# EAGLE schematic cs_debug_v1 (EAGLE 9.6.1)

## Sheet 1 of 3
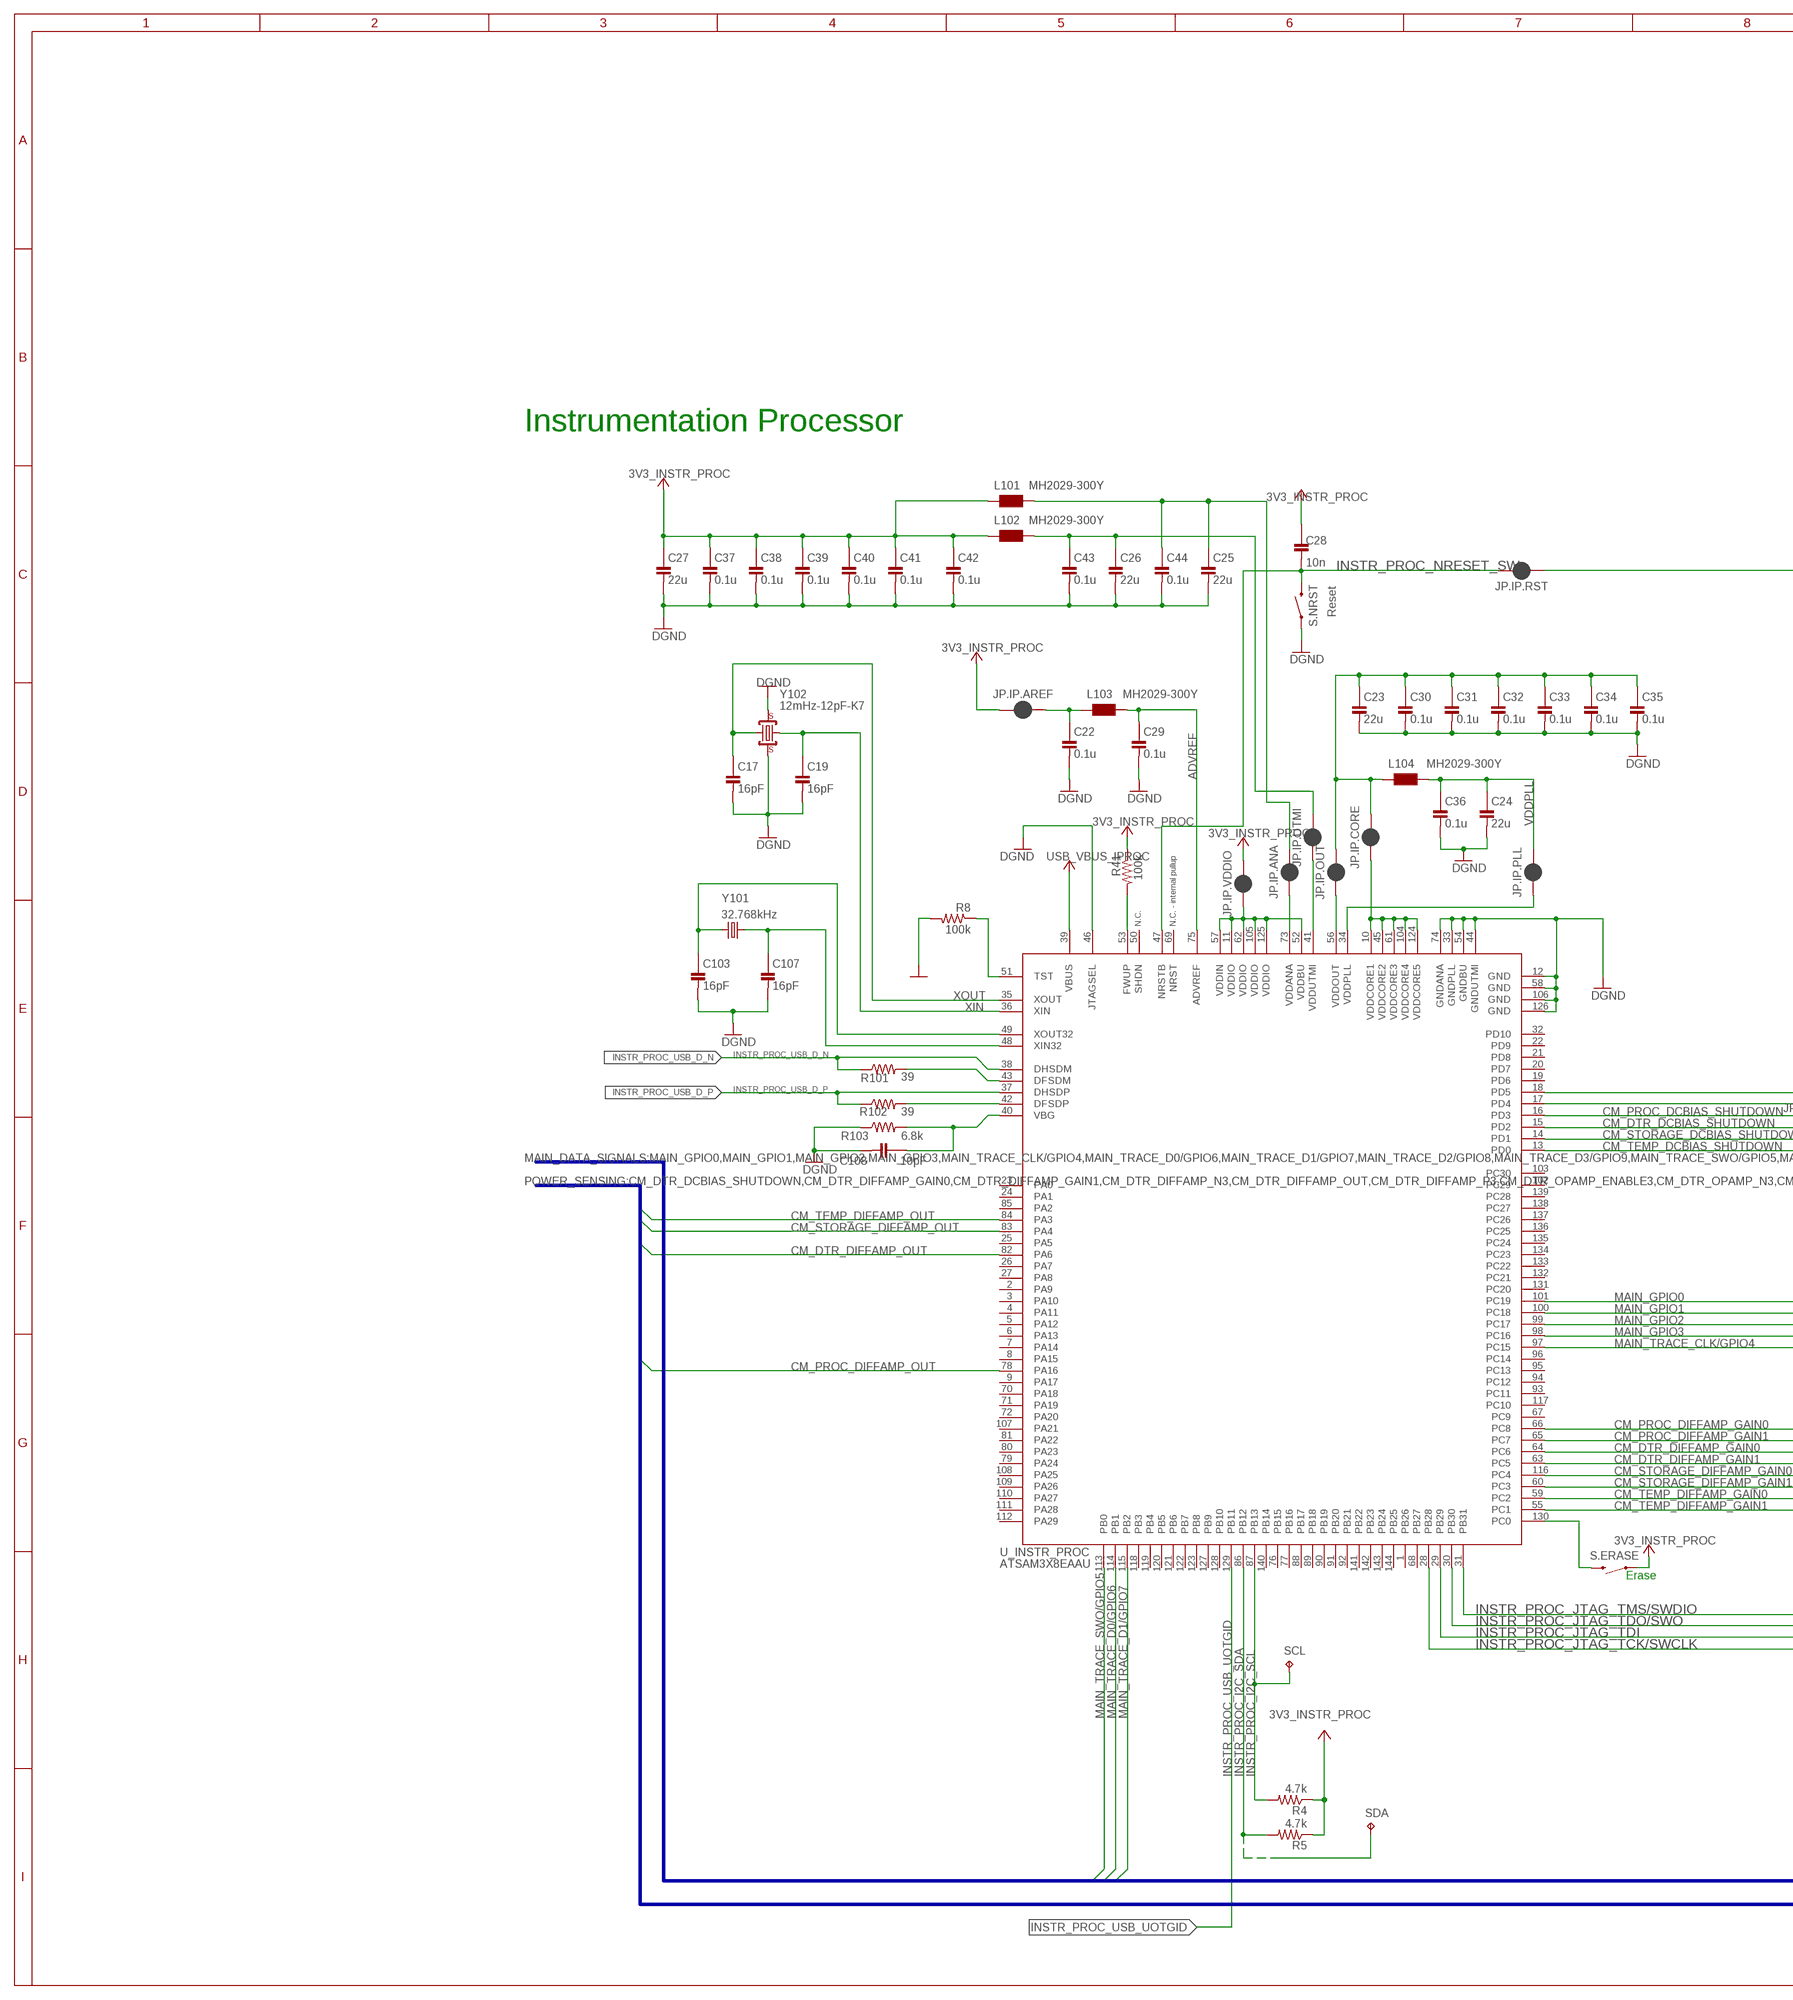
[diagram p0: schematic, sheet 1, part 1 of 2]
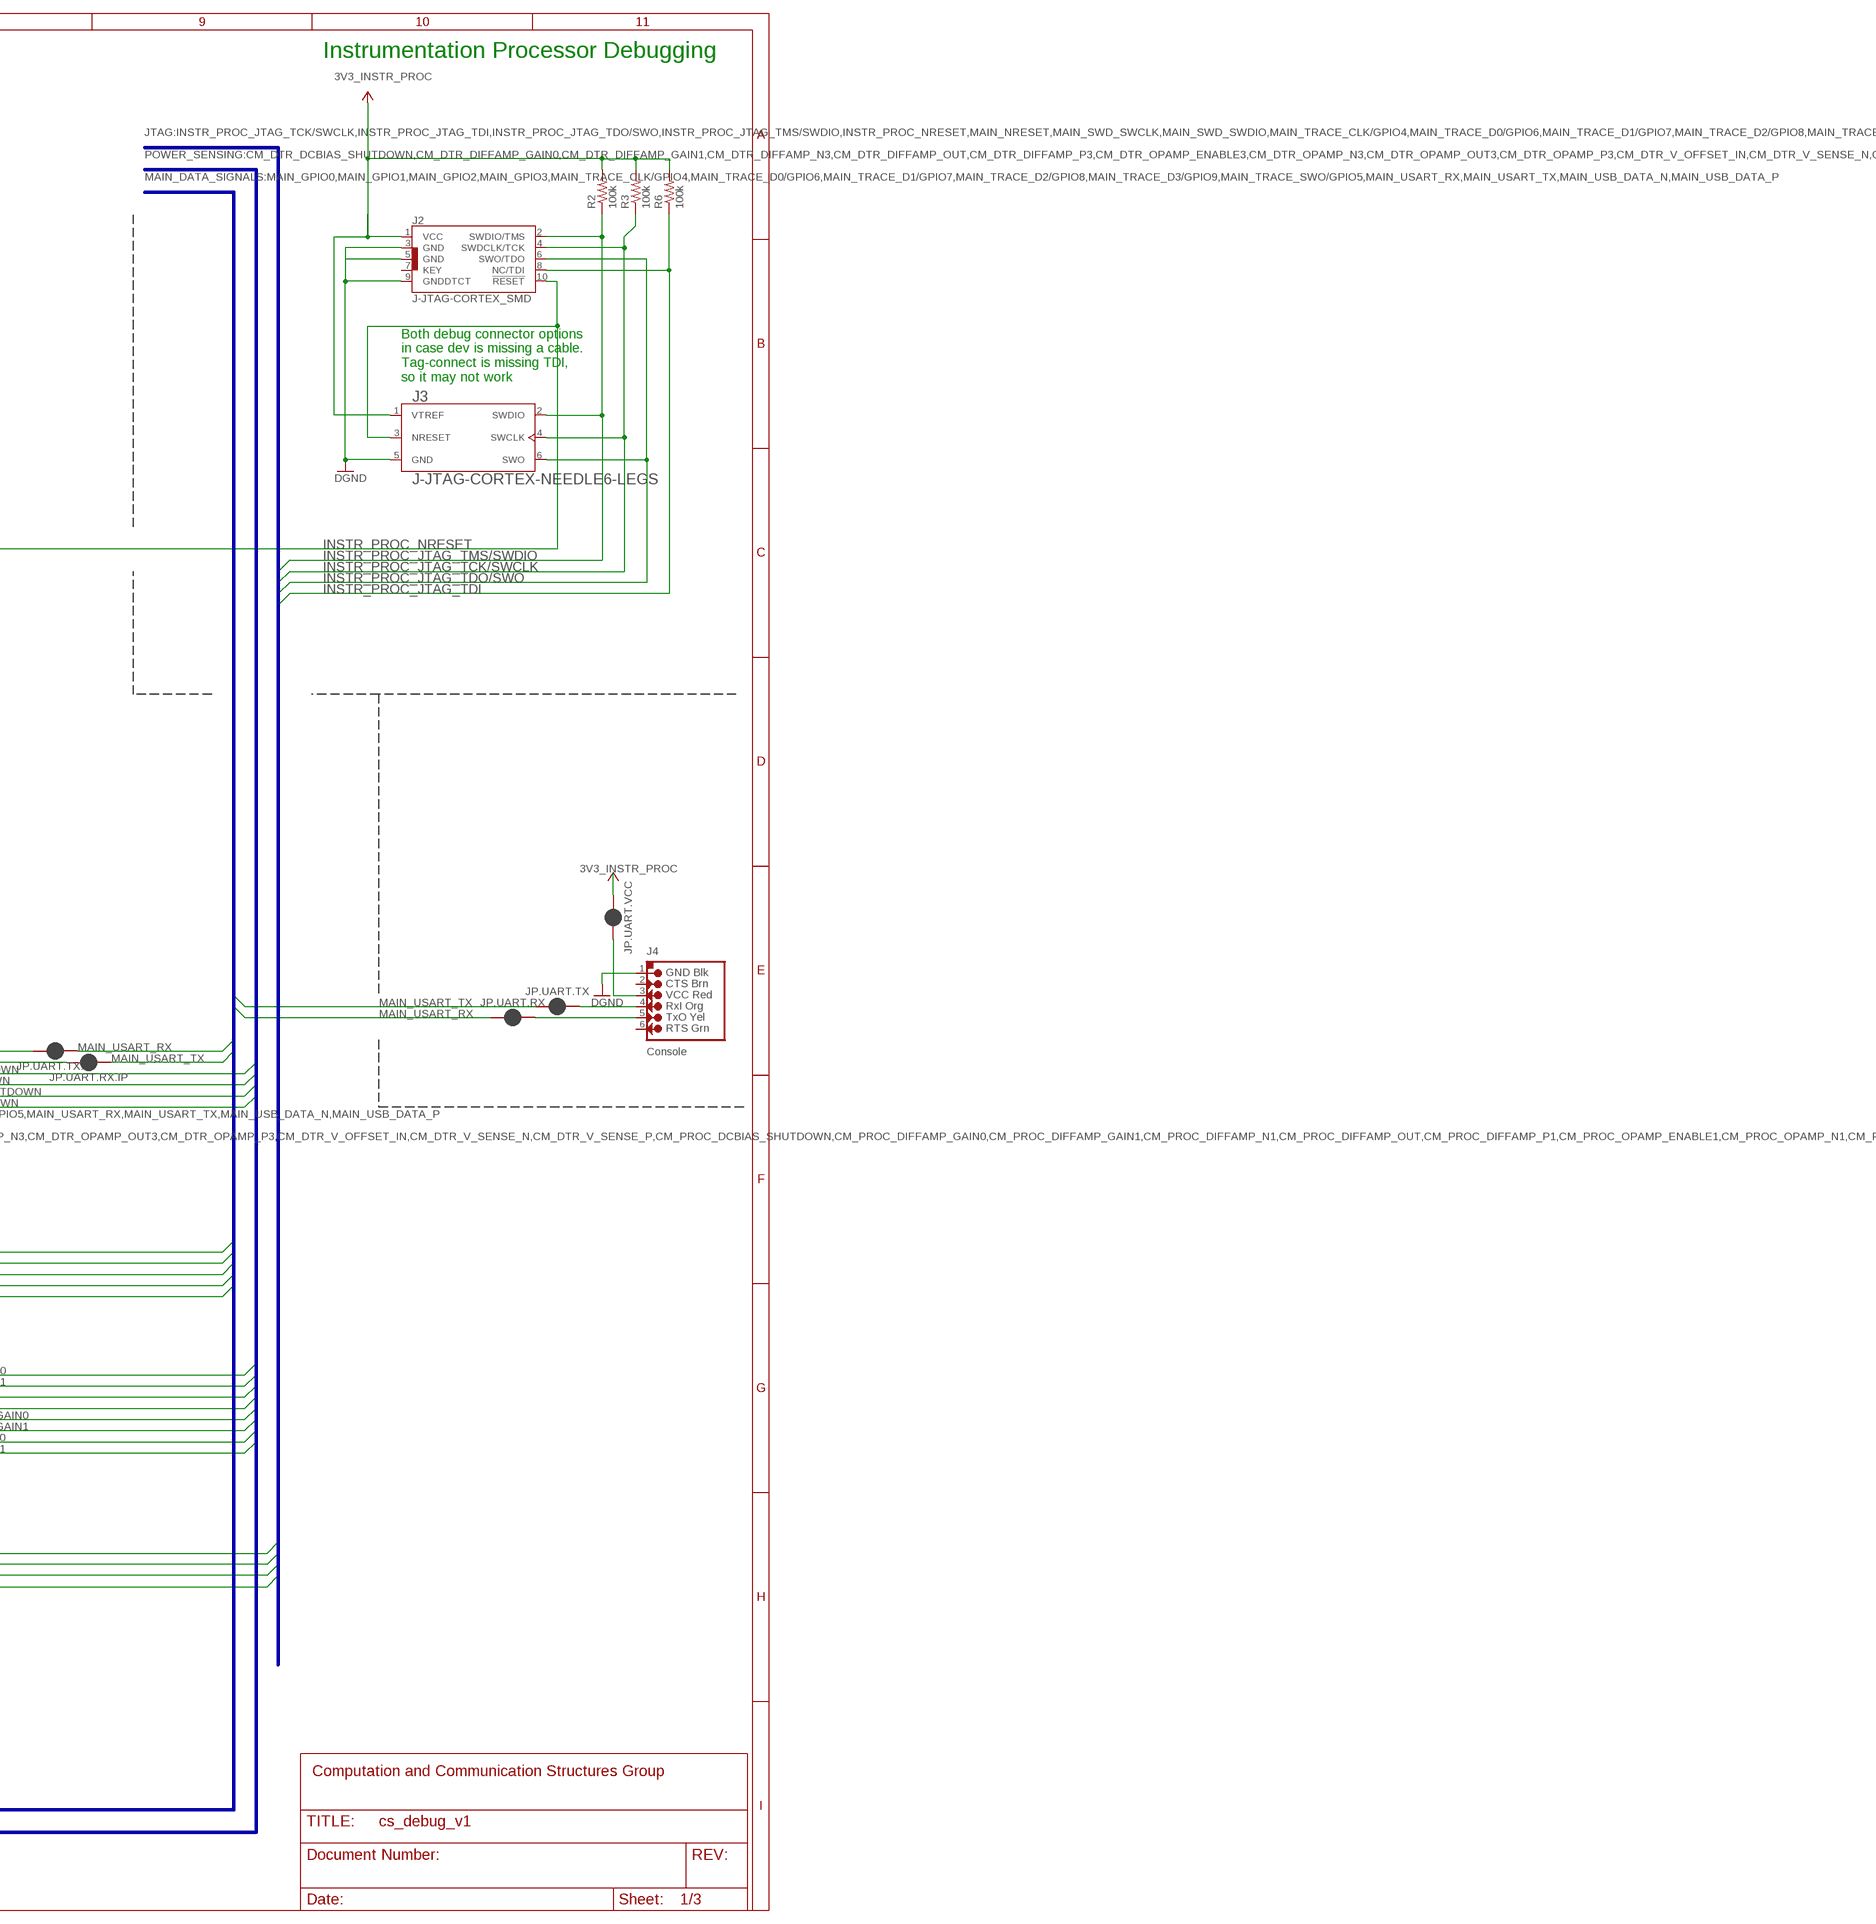
[diagram p1: schematic, sheet 1, part 2 of 2]

### Parts
C17  16pF  C-0603  [C0603]
C19  16pF  C-0603  [C0603]
C22  0.1u  C-0402  [C0402]
C23  22u  C-0805  [C0805]
C24  22u  C-0805  [C0805]
C25  22u  C-0805  [C0805]
C26  22u  C-0805  [C0805]
C27  22u  C-0805  [C0805]
C28  10n  C-0402  [C0402]
C29  0.1u  C-0402  [C0402]
C30  0.1u  C-0402  [C0402]
C31  0.1u  C-0402  [C0402]
C32  0.1u  C-0402  [C0402]
C33  0.1u  C-0402  [C0402]
C34  0.1u  C-0402  [C0402]
C35  0.1u  C-0402  [C0402]
C36  0.1u  C-0402  [C0402]
C37  0.1u  C-0402  [C0402]
C38  0.1u  C-0402  [C0402]
C39  0.1u  C-0402  [C0402]
C40  0.1u  C-0402  [C0402]
C41  0.1u  C-0402  [C0402]
C42  0.1u  C-0402  [C0402]
C43  0.1u  C-0402  [C0402]
C44  0.1u  C-0402  [C0402]
C103  16pF  C-0603  [C0603]
C107  16pF  C-0603  [C0603]
C108  10pF  C-0603  [C0603]
J2  J-JTAG-CORTEX_SMD  [SAMTECH_FTSH-105-01]
J3  J-JTAG-CORTEX-NEEDLE6-LEGS  [8.06.16_6-PIN_NEEDLE_ADAPTER_LEGS]
J4  J-SERIAL-PORT  [HEADER-1X6]
JP.IP.ANA  JUMPER-SMT_2_NC_PASTE_NO-SILK  [SMT-JUMPER_2_NC_PASTE_NO-SILK]
JP.IP.AREF  JUMPER-SMT_2_NC_PASTE_NO-SILK  [SMT-JUMPER_2_NC_PASTE_NO-SILK]
JP.IP.CORE  JUMPER-SMT_2_NC_PASTE_NO-SILK  [SMT-JUMPER_2_NC_PASTE_NO-SILK]
JP.IP.OUT  JUMPER-SMT_2_NC_PASTE_NO-SILK  [SMT-JUMPER_2_NC_PASTE_NO-SILK]
JP.IP.PLL  JUMPER-SMT_2_NC_PASTE_NO-SILK  [SMT-JUMPER_2_NC_PASTE_NO-SILK]
JP.IP.RST  JUMPER-SMT_2_NC_PASTE_NO-SILK  [SMT-JUMPER_2_NC_PASTE_NO-SILK]
JP.IP.UTMI  JUMPER-SMT_2_NC_PASTE_NO-SILK  [SMT-JUMPER_2_NC_PASTE_NO-SILK]
JP.IP.VDDIO  JUMPER-SMT_2_NC_PASTE_NO-SILK  [SMT-JUMPER_2_NC_PASTE_NO-SILK]
JP.UART.RX  JUMPER-SMT_2_NC_PASTE_NO-SILK  [SMT-JUMPER_2_NC_PASTE_NO-SILK]
JP.UART.RX.IP  JUMPER-SMT_2_NC_PASTE_NO-SILK  [SMT-JUMPER_2_NC_PASTE_NO-SILK]
JP.UART.TX  JUMPER-SMT_2_NC_PASTE_NO-SILK  [SMT-JUMPER_2_NC_PASTE_NO-SILK]
JP.UART.TX.IP  JUMPER-SMT_2_NC_PASTE_NO-SILK  [SMT-JUMPER_2_NC_PASTE_NO-SILK]
JP.UART.VCC  JUMPER-SMT_2_NC_PASTE_NO-SILK  [SMT-JUMPER_2_NC_PASTE_NO-SILK]
L101  MH2029-300Y  [L0805]
L102  MH2029-300Y  [L0805]
L103  MH2029-300Y  [L0805]
L104  MH2029-300Y  [L0805]
R2  100k  R-0402  [R0402]
R3  100k  R-0402  [R0402]
R4  4.7k  R-0402  [R0402]
R5  4.7k  R-0402  [R0402]
R6  100k  R-0402  [R0402]
R8  100k  R-0402  [R0402]
R41  100k  R-0402  [R0402]
R101  39  R-0402  [R0402]
R102  39  R-0402  [R0402]
R103  6.8k  R-0402  [R0402]
S.ERASE  Momentary  SW_EVQ-P7L01P_SPST_RA  [SW_EVQ-P7L01P]
S.NRST  Momentary  SW_EVQ-P7L01P_SPST_RA  [SW_EVQ-P7L01P]
SCL  TPTP10SQ  [TP10SQ]
SDA  TPTP10SQ  [TP10SQ]
U_INSTR_PROC  ATSAM3X8EA-AU  ATSAM3X8EAAU  [LQFP144]
Y101  32.768kHz  CRYSTAL3.2X1.5MM  [CRYSTAL-SMD-3.2X1.5MM]
Y102  12mHz-12pF-K7  0396_12MHZ-12PF-K7  [CRYSTAL-3.2-2.5]

### Nets
3V3_INSTR_PROC [power]: C27.1 C28.1 C37.1 C38.1 C39.1 C40.1 C41.1 C42.1 J2.1(VCC) J3.1(VTREF) JP.IP.AREF.1 JP.IP.VDDIO.2 JP.UART.VCC.1 L101.1 L102.1 R2.2 R3.2 R4.1 R5.1 R6.2 R41.1 S.ERASE.1_1 S.ERASE.1_2 ; supply symbol labelled +3V3 ; also sheet 2
ADVREF [power]: C29.1 L103.2 U_INSTR_PROC.75(ADVREF)
ADVREF_PRE [power]: C22.1 JP.IP.AREF.2 L103.1
CM_DTR_DCBIAS_SHUTDOWN: U_INSTR_PROC.15(PD2) ; also sheet 3
CM_DTR_DIFFAMP_GAIN0: U_INSTR_PROC.64(PC6) ; also sheet 3
CM_DTR_DIFFAMP_GAIN1: U_INSTR_PROC.63(PC5) ; also sheet 3
CM_DTR_DIFFAMP_OUT: U_INSTR_PROC.82(PA6) ; also sheet 3
CM_PROC_DCBIAS_SHUTDOWN: U_INSTR_PROC.16(PD3) ; also sheet 3
CM_PROC_DIFFAMP_GAIN0: U_INSTR_PROC.66(PC8) ; also sheet 3
CM_PROC_DIFFAMP_GAIN1: U_INSTR_PROC.65(PC7) ; also sheet 3
CM_PROC_DIFFAMP_OUT: U_INSTR_PROC.78(PA16) ; also sheet 3
CM_STORAGE_DCBIAS_SHUTDOWN: U_INSTR_PROC.14(PD1) ; also sheet 3
CM_STORAGE_DIFFAMP_GAIN0: U_INSTR_PROC.116(PC4) ; also sheet 3
CM_STORAGE_DIFFAMP_GAIN1: U_INSTR_PROC.60(PC3) ; also sheet 3
CM_STORAGE_DIFFAMP_OUT: U_INSTR_PROC.83(PA4) ; also sheet 3
CM_TEMP_DCBIAS_SHUTDOWN: U_INSTR_PROC.13(PD0) ; also sheet 3
CM_TEMP_DIFFAMP_GAIN0: U_INSTR_PROC.59(PC2) ; also sheet 3
CM_TEMP_DIFFAMP_GAIN1: U_INSTR_PROC.55(PC1) ; also sheet 3
CM_TEMP_DIFFAMP_OUT: U_INSTR_PROC.84(PA3) ; also sheet 3
DGND [GND]: C17.2 C19.2 C22.2 C23.2 C24.2 C25.2 C26.2 C27.2 C29.2 C30.2 C31.2 C32.2 C33.2 C34.2 C35.2 C36.2 C37.2 C38.2 C39.2 C40.2 C41.2 C42.2 C43.2 C44.2 C103.2 C107.2 C108.2 J2.3(GND) J2.5(GND) J2.9(GNDDTCT) J3.5(GND) J4.1(GND) R8.2 R103.1 S.NRST.1_1 S.NRST.1_2 U_INSTR_PROC.12(GND) U_INSTR_PROC.33(GNDPLL) U_INSTR_PROC.44(GNDUTMI) U_INSTR_PROC.46(JTAGSEL) U_INSTR_PROC.54(GNDBU) U_INSTR_PROC.58(GND) U_INSTR_PROC.74(GNDANA) U_INSTR_PROC.106(GND) U_INSTR_PROC.126(GND) Y102.2(GND) Y102.4(GND) ; supply symbol labelled GND ; also sheet 2
ERASE_S: S.ERASE.2_1 S.ERASE.2_2 U_INSTR_PROC.130(PC0)
FWUP: R41.2 U_INSTR_PROC.53(FWUP)
INSTR_PROC_I2C_SCL: R4.2 SCL.TP U_INSTR_PROC.87(PB13) ; also sheet 3
INSTR_PROC_I2C_SDA: R5.2 SDA.TP U_INSTR_PROC.86(PB12) ; also sheet 3
INSTR_PROC_JTAG_TCK/SWCLK: J2.4(SWDCLK/TCK) J3.4(SWCLK) R3.1 U_INSTR_PROC.28(PB28)
INSTR_PROC_JTAG_TDI: J2.8(NC/TDI) R6.1 U_INSTR_PROC.29(PB29)
INSTR_PROC_JTAG_TDO/SWO: J2.6(SWO/TDO) J3.6(SWO) U_INSTR_PROC.30(PB30)
INSTR_PROC_JTAG_TMS/SWDIO: J2.2(SWDIO/TMS) J3.2(SWDIO) R2.1 U_INSTR_PROC.31(PB31)
INSTR_PROC_NRESET: J2.10(!RESET) J3.3(NRESET) JP.IP.RST.1
INSTR_PROC_NRESET_SW: C28.2 JP.IP.RST.2 S.NRST.2_1 S.NRST.2_2 U_INSTR_PROC.47(NRSTB)
INSTR_PROC_USB_D_N: R101.1 U_INSTR_PROC.38(DHSDM) ; also sheet 2
INSTR_PROC_USB_D_P: R102.1 U_INSTR_PROC.37(DHSDP) ; also sheet 2
INSTR_PROC_USB_UOTGID [power]: U_INSTR_PROC.129(PB11)
MAIN_GPIO0: U_INSTR_PROC.101(PC19) ; also sheet 2
MAIN_GPIO1: U_INSTR_PROC.100(PC18) ; also sheet 2
MAIN_GPIO2: U_INSTR_PROC.99(PC17) ; also sheet 2
MAIN_GPIO3: U_INSTR_PROC.98(PC16) ; also sheet 2
MAIN_TRACE_CLK/GPIO4: U_INSTR_PROC.97(PC15) ; also sheet 2
MAIN_TRACE_D0/GPIO6: U_INSTR_PROC.114(PB1) ; also sheet 2
MAIN_TRACE_D1/GPIO7: U_INSTR_PROC.115(PB2) ; also sheet 2
MAIN_TRACE_SWO/GPIO5: U_INSTR_PROC.113(PB0) ; also sheet 2
MAIN_USART_RX: JP.UART.RX.1 JP.UART.TX.IP.1 ; also sheet 2
MAIN_USART_TX: JP.UART.RX.IP.1 JP.UART.TX.1 ; also sheet 2
N$2: R102.2 U_INSTR_PROC.42(DFSDP)
N$3: JP.UART.TX.IP.2 U_INSTR_PROC.18(PD5)
N$5: JP.UART.RX.IP.2 U_INSTR_PROC.17(PD4)
N$7: J4.4(RX-I) JP.UART.TX.2
N$9: J4.5(TX-O) JP.UART.RX.2
N$11: J4.3(VCC-I) JP.UART.VCC.2
N$13: R101.2 U_INSTR_PROC.43(DFSDM)
TST: R8.1 U_INSTR_PROC.51(TST)
USB_VBUS_IPROC [power]: U_INSTR_PROC.39(VBUS) ; supply symbol labelled +3V3 ; also sheet 2
VBG: C108.1 R103.2 U_INSTR_PROC.40(VBG)
VDDANA1 [power]: C25.1 C44.1 JP.IP.ANA.2 L101.2
VDDANA_0 [power]: JP.IP.ANA.1 U_INSTR_PROC.73(VDDANA)
VDDIO1 [power]: JP.IP.VDDIO.1 U_INSTR_PROC.11(VDDIO) U_INSTR_PROC.52(VDDBU) U_INSTR_PROC.57(VDDIN) U_INSTR_PROC.62(VDDIO) U_INSTR_PROC.105(VDDIO) U_INSTR_PROC.125(VDDIO)
VDDOUT [power]: C23.1 C30.1 C31.1 C32.1 C33.1 C34.1 C35.1 JP.IP.CORE.2 JP.IP.OUT.2 L104.1
VDDOUT_0 [power]: JP.IP.OUT.1 U_INSTR_PROC.56(VDDOUT)
VDDOUT_1 [power]: JP.IP.CORE.1 U_INSTR_PROC.10(VDDCORE1) U_INSTR_PROC.45(VDDCORE2) U_INSTR_PROC.61(VDDCORE3) U_INSTR_PROC.104(VDDCORE4) U_INSTR_PROC.124(VDDCORE5)
VDDOUTMI [power]: C26.1 C43.1 JP.IP.UTMI.2 L102.2
VDDOUTMI_0 [power]: JP.IP.UTMI.1 U_INSTR_PROC.41(VDDUTMI)
VDDPLL [power]: C24.1 C36.1 JP.IP.PLL.2 L104.2
VDDPLL_0 [power]: JP.IP.PLL.1 U_INSTR_PROC.34(VDDPLL)
XIN: C19.1 U_INSTR_PROC.36(XIN) Y102.1(C1)
XIN32: C107.1 U_INSTR_PROC.48(XIN32) Y101.P$1
XOUT: C17.1 U_INSTR_PROC.35(XOUT) Y102.3(C2)
XOUT32: C103.1 U_INSTR_PROC.49(XOUT32) Y101.P$2
Unconnected: J2.7(KEY) J4.2(CTS-O) J4.6(RTS) U_INSTR_PROC.1(PB26) U_INSTR_PROC.2(PA9) U_INSTR_PROC.3(PA10) U_INSTR_PROC.4(PA11) U_INSTR_PROC.5(PA12) U_INSTR_PROC.6(PA13) U_INSTR_PROC.7(PA14) U_INSTR_PROC.8(PA15) U_INSTR_PROC.9(PA17) U_INSTR_PROC.19(PD6) U_INSTR_PROC.20(PD7) U_INSTR_PROC.21(PD8) U_INSTR_PROC.22(PD9) U_INSTR_PROC.23(PA0) U_INSTR_PROC.24(PA1) U_INSTR_PROC.25(PA5) U_INSTR_PROC.26(PA7) U_INSTR_PROC.27(PA8) U_INSTR_PROC.32(PD10) U_INSTR_PROC.50(SHDN) U_INSTR_PROC.67(PC9) U_INSTR_PROC.68(PB27) U_INSTR_PROC.69(NRST) U_INSTR_PROC.70(PA18) U_INSTR_PROC.71(PA19) U_INSTR_PROC.72(PA20) U_INSTR_PROC.76(PB15) U_INSTR_PROC.77(PB16) U_INSTR_PROC.79(PA24) U_INSTR_PROC.80(PA23) U_INSTR_PROC.81(PA22) U_INSTR_PROC.85(PA2) U_INSTR_PROC.88(PB17) U_INSTR_PROC.89(PB18) U_INSTR_PROC.90(PB19) U_INSTR_PROC.91(PB20) U_INSTR_PROC.92(PB21) U_INSTR_PROC.93(PC11) U_INSTR_PROC.94(PC12) U_INSTR_PROC.95(PC13) U_INSTR_PROC.96(PC14) U_INSTR_PROC.102(PC29) U_INSTR_PROC.103(PC30) U_INSTR_PROC.107(PA21) U_INSTR_PROC.108(PA25) U_INSTR_PROC.109(PA26) U_INSTR_PROC.110(PA27) U_INSTR_PROC.111(PA28) U_INSTR_PROC.112(PA29) U_INSTR_PROC.117(PC10) U_INSTR_PROC.118(PB3) U_INSTR_PROC.119(PB4) U_INSTR_PROC.120(PB5) U_INSTR_PROC.121(PB6) U_INSTR_PROC.122(PB7) U_INSTR_PROC.123(PB8) U_INSTR_PROC.127(PB9) U_INSTR_PROC.128(PB10) U_INSTR_PROC.131(PC20) U_INSTR_PROC.132(PC21) U_INSTR_PROC.133(PC22) U_INSTR_PROC.134(PC23) U_INSTR_PROC.135(PC24) U_INSTR_PROC.136(PC25) U_INSTR_PROC.137(PC26) U_INSTR_PROC.138(PC27) U_INSTR_PROC.139(PC28) U_INSTR_PROC.140(PB14) U_INSTR_PROC.141(PB22) U_INSTR_PROC.142(PB23) U_INSTR_PROC.143(PB24) U_INSTR_PROC.144(PB25)

### Buses
JTAG:INSTR_PROC_JTAG_TCK/SWCLK,INSTR_PROC_JTAG_TDI,INSTR_PROC_JTAG_TDO/SWO,INSTR_PROC_JTAG_TMS/SWDIO,INSTR_PROC_NRESET,MAIN_NRESET,MAIN_SWD_SWCLK,MAIN_SWD_SWDIO,MAIN_TRACE_CLK/GPIO4,MAIN_TRACE_D0/GPIO6,MAIN_TRACE_D1/GPIO7,MAIN_TRACE_D2/GPIO8,MAIN_TRACE_D3/GPIO9,MAIN_TRACE_SWO/GPIO5
POWER_SENSING:CM_DTR_DCBIAS_SHUTDOWN,CM_DTR_DIFFAMP_GAIN0,CM_DTR_DIFFAMP_GAIN1,CM_DTR_DIFFAMP_N3,CM_DTR_DIFFAMP_OUT,CM_DTR_DIFFAMP_P3,CM_DTR_OPAMP_ENABLE3,CM_DTR_OPAMP_N3,CM_DTR_OPAMP_OUT3,CM_DTR_OPAMP_P3,CM_DTR_V_OFFSET_IN,CM_DTR_V_SENSE_N,CM_DTR_V_SENSE_P,CM_PROC_DCBIAS_SHUTDOWN,CM_PROC_DIFFAMP_GAIN0,CM_PROC_DIFFAMP_GAIN1,CM_PROC_DIFFAMP_N1,CM_PROC_DIFFAMP_OUT,CM_PROC_DIFFAMP_P1,CM_PROC_OPAMP_ENABLE1,CM_PROC_OPAMP_N1,CM_PROC_OPAMP_OUT1,CM__PROCOPAMP_P1,CM_PROC_V_OFFSET_IN,CM_PROC_V_SENSE_N,CM_PROC_V_SENSE_P,CM_STORAGE_DCBIAS_SHUTDOWN,CM_STORAGE_DIFFAMP_GAIN0,CM_STORAGE_DIFFAMP_GAIN1,CM_STORAGE_DIFFAMP_N1,CM_STORAGE_DIFFAMP_OUT,CM_STORAGE_DIFFAMP_P1,CM_STORAGE_OPAMP_ENABLE1,CM_STORAGE_OPAMP_N1,CM_STORAGE_OPAMP_OUT1,CM_STORAGE_OPAMP_P1,CM_STORAGE_V_OFFSET_IN,CM_STORAGE_V_SENSE_N,CM_STORAGE_V_SENSE_P,CM_TEMP_DCBIAS_SHUTDOWN,CM_TEMP_DIFFAMP_GAIN0,CM_TEMP_DIFFAMP_GAIN1,CM_TEMP_DIFFAMP_N1,CM_TEMP_DIFFAMP_OUT,CM_TEMP_DIFFAMP_P1,CM_TEMP_OPAMP_ENABLE1,CM_TEMP_OPAMP_N1,CM_TEMP_OPAMP_OUT1,CM_TEMP_OPAMP_P1,CM_TEMP_V_OFFSET_IN,CM_TEMP_V_SENSE_N,CM_TEMP_V_SENSE_P,V_SENSE_P
MAIN_DATA_SIGNALS:MAIN_GPIO0,MAIN_GPIO1,MAIN_GPIO2,MAIN_GPIO3,MAIN_TRACE_CLK/GPIO4,MAIN_TRACE_D0/GPIO6,MAIN_TRACE_D1/GPIO7,MAIN_TRACE_D2/GPIO8,MAIN_TRACE_D3/GPIO9,MAIN_TRACE_SWO/GPIO5,MAIN_USART_RX,MAIN_USART_TX,MAIN_USB_DATA_N,MAIN_USB_DATA_P

### Notes on the sheet
- Instrumentation Processor Debugging
- Both debug connector options
  in case dev is missing a cable.
  Tag-connect is missing TDI,
  so it may not work
- Instrumentation Processor
- Reset
- N.C. | N.C. - internal pullup
- Erase
- Computation and Communication Structures Group

## Sheet 2 of 3
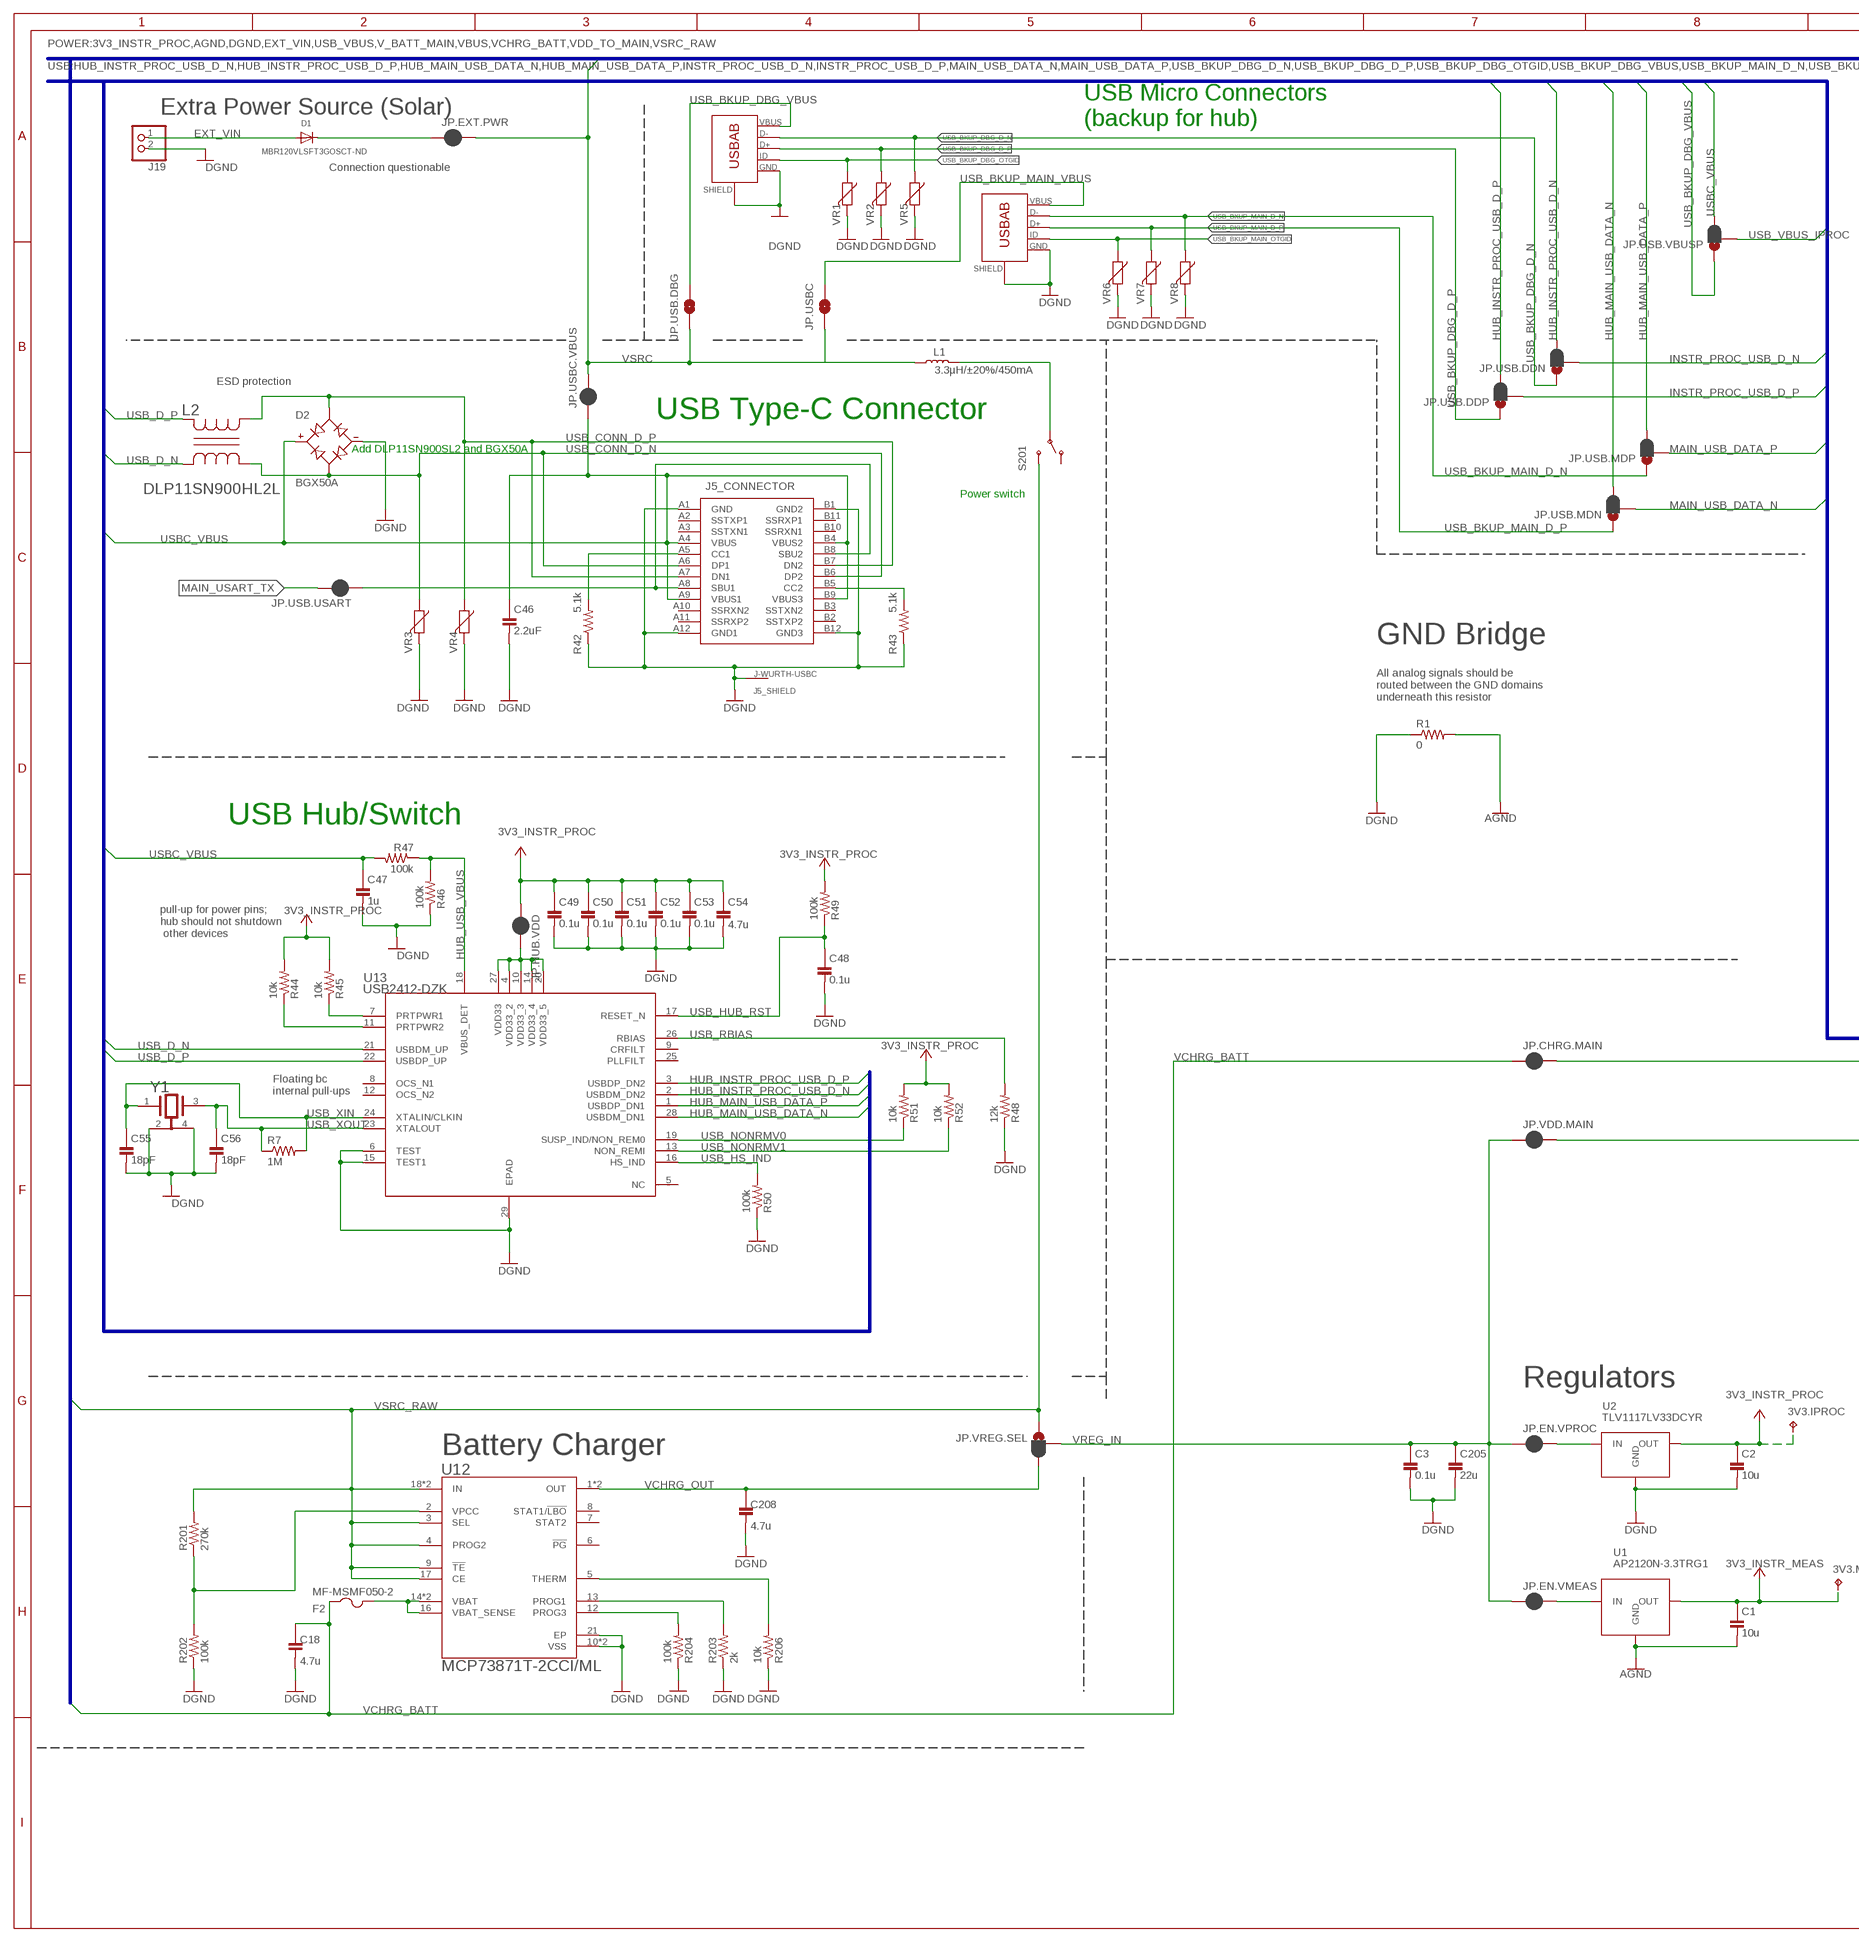
[diagram p2: schematic, sheet 2, part 1 of 2]
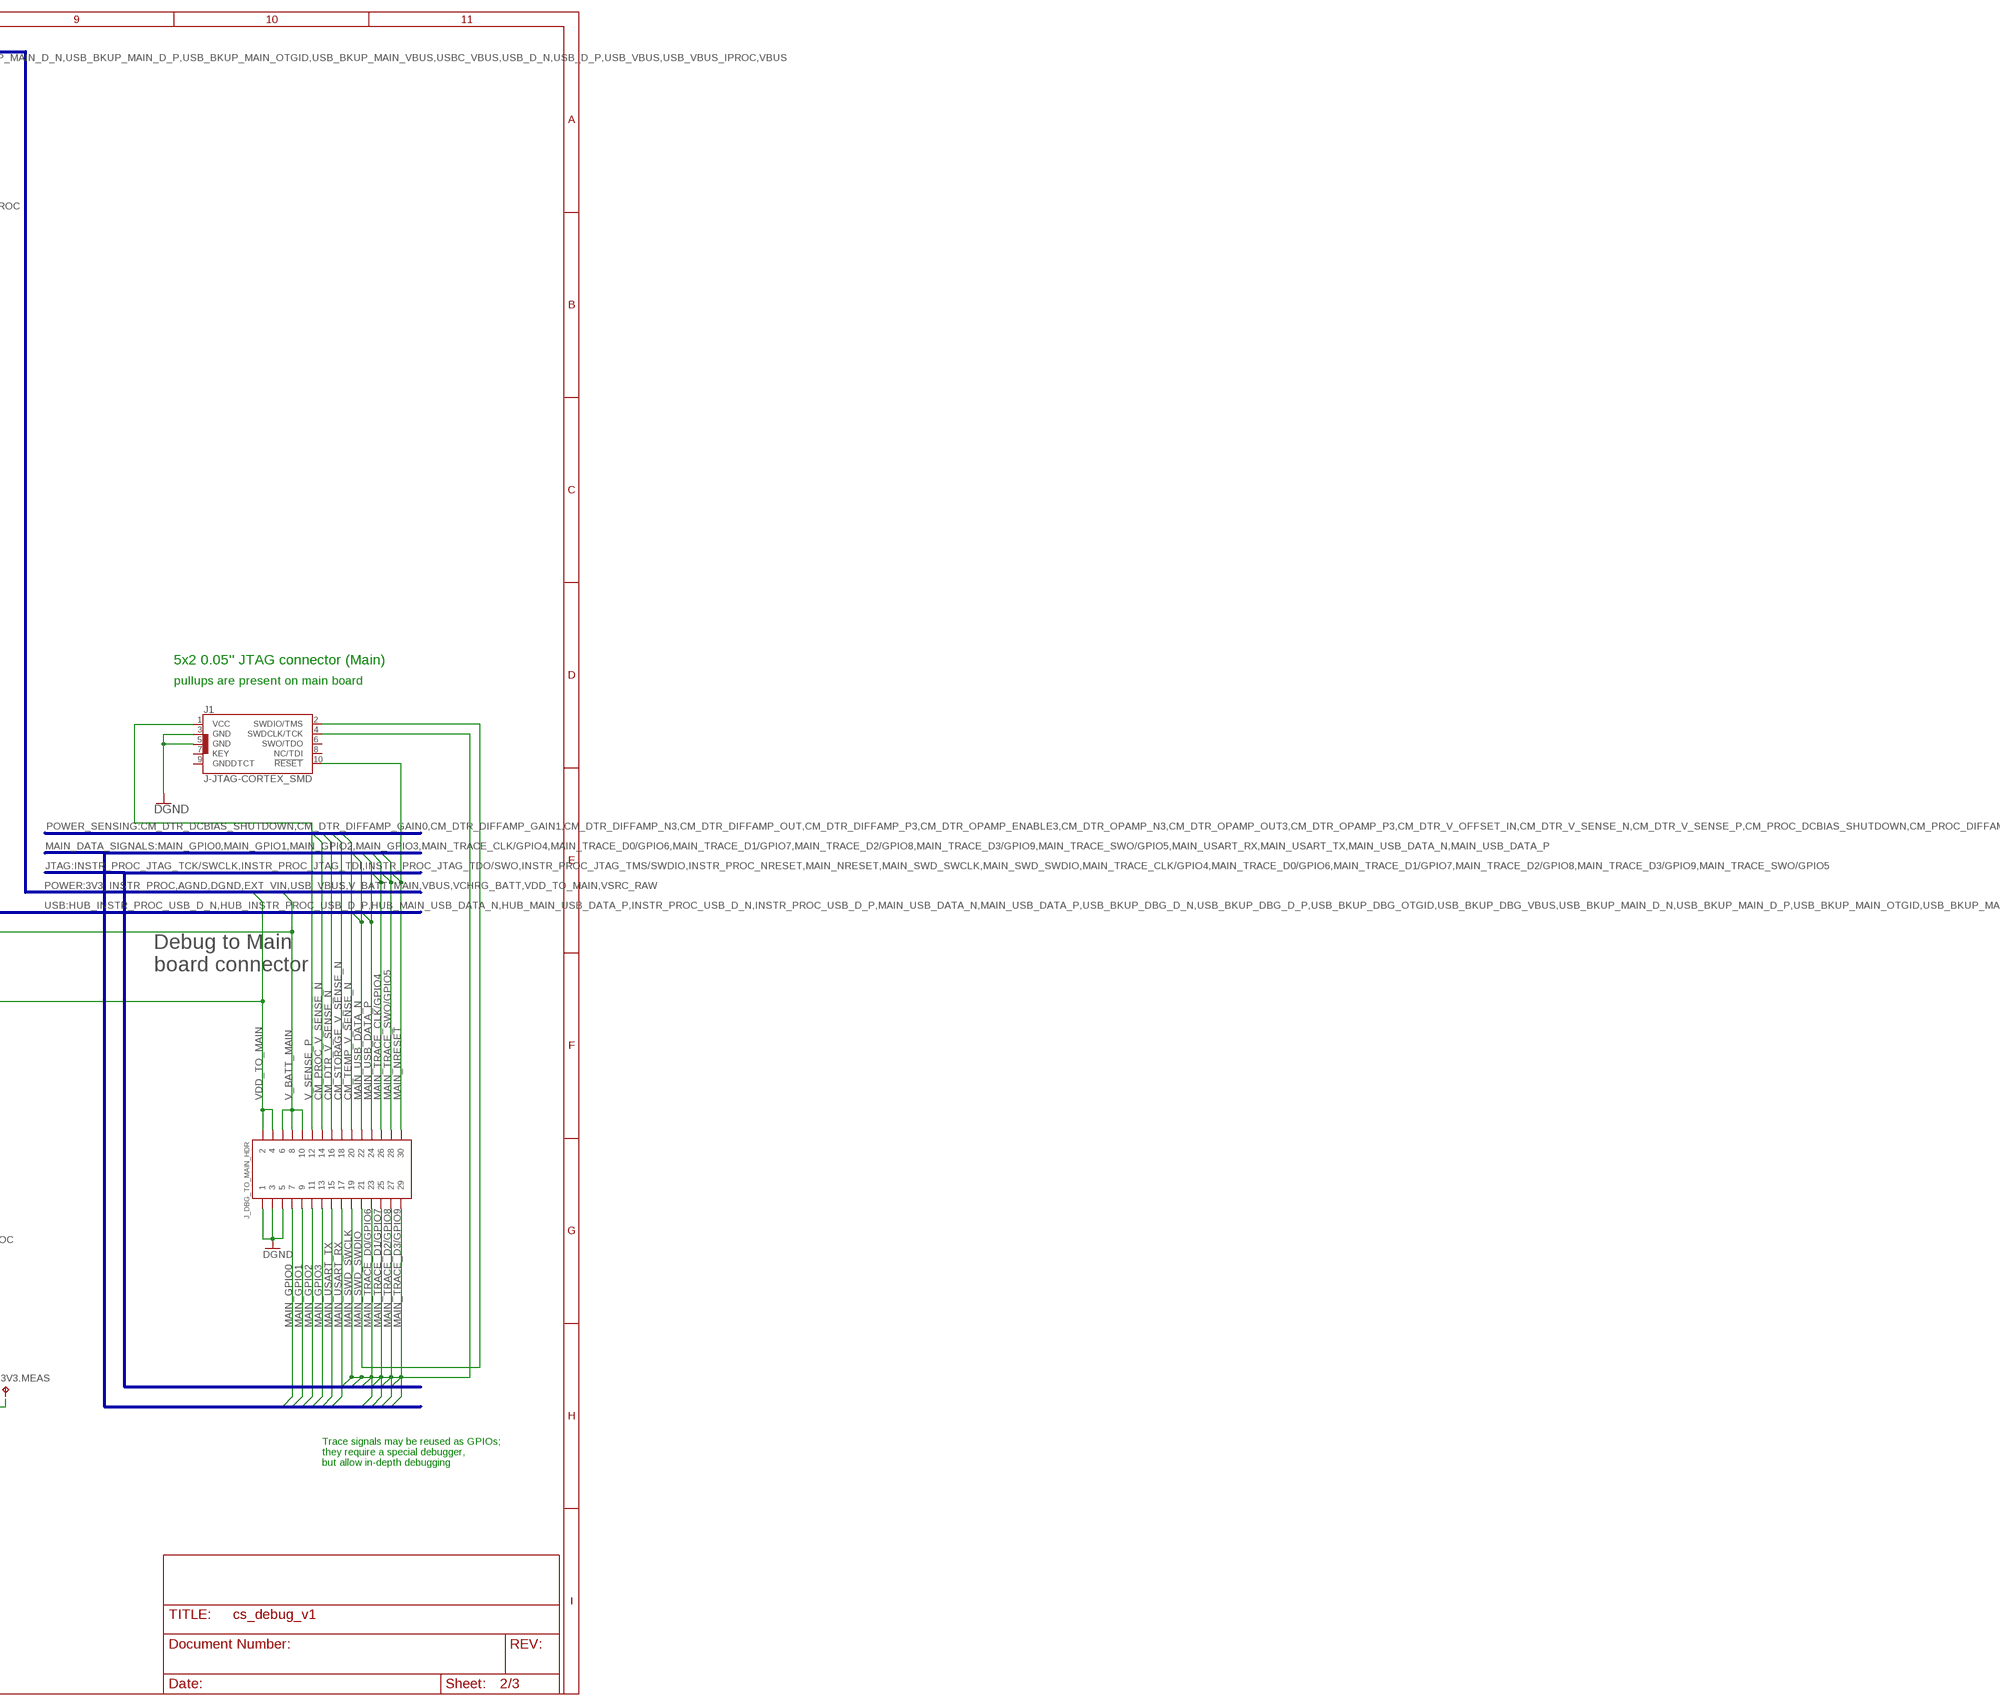
[diagram p3: schematic, sheet 2, part 2 of 2]

### Parts
3V3.IPROC  TPTP10SQ  [TP10SQ]
3V3.MEAS  TPTP10SQ  [TP10SQ]
C1  10u  C-0805  [C0805]
C2  10u  C-0805  [C0805]
C3  0.1u  C-0402  [C0402]
C18  4.7u  C-0402  [C0402]
C46  2.2uF  C-0603  [C0603]
C47  1u  C-0402  [C0402]
C48  0.1u  C-0402  [C0402]
C49  0.1u  C-0402  [C0402]
C50  0.1u  C-0402  [C0402]
C51  0.1u  C-0402  [C0402]
C52  0.1u  C-0402  [C0402]
C53  0.1u  C-0402  [C0402]
C54  4.7u  C-0402  [C0402]
C55  18pF  C-0402  [C0402]
C56  18pF  C-0402  [C0402]
C205  22u  C-0805  [C0805]
C208  4.7u  C-0402  [C0402]
D1  MBR120VLSFT3GOSCT-ND  DIODESOD-123  [SOD-123]
D2  BGX50A  [SOT143_BGX50A]
F2  MF-MSMF050-2  PTCFUSE-1812  [1812]
J1  J-JTAG-CORTEX_SMD  [SAMTECH_FTSH-105-01]
J5  J-WURTH-USBC  [632723X00011]
J19  Solar  J-JST2-SMT-RA  [JST-PH-2-SMT-RA]
J.USB.DBG  USBABSMTDIP  [ZX62D-AB-5P8]
J.USB.MN  USBABSMTDIP  [ZX62D-AB-5P8]
J_DBG_TO_MAIN_HDR  HIROSE-DF40_30-PIN_CONNECTORS-HEADER  [HRS_DF40C-30DP-0.4V(51)]
JP.CHRG.MAIN  JUMPER-SMT_2_NC_PASTE_NO-SILK  [SMT-JUMPER_2_NC_PASTE_NO-SILK]
JP.EN.VMEAS  JUMPER-SMT_2_NC_PASTE_NO-SILK  [SMT-JUMPER_2_NC_PASTE_NO-SILK]
JP.EN.VPROC  JUMPER-SMT_2_NC_PASTE_NO-SILK  [SMT-JUMPER_2_NC_PASTE_NO-SILK]
JP.EXT.PWR  JUMPER-SMT_2_NC_PASTE_NO-SILK  [SMT-JUMPER_2_NC_PASTE_NO-SILK]
JP.HUB.VDD  JUMPER-SMT_2_NC_PASTE_NO-SILK  [SMT-JUMPER_2_NC_PASTE_NO-SILK]
JP.USB.DBG  JUMPER-SMT_2_NO_PASTEFREE  [SMT-JUMPER_2_NO_PASTEFREE_NO-SILK]
JP.USB.DDN  JUMPER-SMT_3_1-NC_PASTE_NO-SILK  [SMT-JUMPER_3_1-NC_PASTE_NO-SILK]
JP.USB.DDP  JUMPER-SMT_3_1-NC_PASTE_NO-SILK  [SMT-JUMPER_3_1-NC_PASTE_NO-SILK]
JP.USB.MDN  JUMPER-SMT_3_1-NC_PASTE_NO-SILK  [SMT-JUMPER_3_1-NC_PASTE_NO-SILK]
JP.USB.MDP  JUMPER-SMT_3_1-NC_PASTE_NO-SILK  [SMT-JUMPER_3_1-NC_PASTE_NO-SILK]
JP.USB.USART  JUMPER-SMT_2_NC_PASTE_NO-SILK  [SMT-JUMPER_2_NC_PASTE_NO-SILK]
JP.USB.VBUSP  JUMPER-SMT_3_1-NC_PASTE_NO-SILK  [SMT-JUMPER_3_1-NC_PASTE_NO-SILK]
JP.USBC  JUMPER-SMT_2_NO_PASTEFREE  [SMT-JUMPER_2_NO_PASTEFREE_NO-SILK]
JP.USBC.VBUS  JUMPER-SMT_2_NC_PASTE_NO-SILK  [SMT-JUMPER_2_NC_PASTE_NO-SILK]
JP.VDD.MAIN  JUMPER-SMT_2_NC_PASTE_NO-SILK  [SMT-JUMPER_2_NC_PASTE_NO-SILK]
JP.VREG.SEL  JUMPER-SMT_3_1-NC_PASTE_NO-SILK  [SMT-JUMPER_3_1-NC_PASTE_NO-SILK]
L1  3.3µH/±20%/450mA  INDUCTOR-0805-3.3UH  [0805]
L2  DLP11SN900HL2L  [IND_DLP11S_0504_MUR]
R1  0  R-2010  [R2010]
R7  1M  R-0402  [R0402]
R42  5.1k  R-0603  [R0603]
R43  5.1k  R-0603  [R0603]
R44  10k  R-0402  [R0402]
R45  10k  R-0402  [R0402]
R46  100k  R-0402  [R0402]
R47  100k  R-0402  [R0402]
R48  12k  R-0402  [R0402]
R49  100k  R-0402  [R0402]
R50  100k  R-0402  [R0402]
R51  10k  R-0402  [R0402]
R52  10k  R-0402  [R0402]
R201  270k  R-0402  [R0402]
R202  100k  R-0402  [R0402]
R203  2k  R-0402  [R0402]
R204  100k  R-0402  [R0402]
R206  10k  R-0402  [R0402]
S201  SLIDESWITCH-SPDT-SMD-RIGHT-ANGLE  [SWITCH_SPST_SMD_A]
U1  AP2120N-3.3TRG1  AP2120N  [SOT23-3_AP2120N]
U2  TLV1117LV33DCYR  [DCY4]
U12  MCP73871T-2CCI/ML  [QFN50P400X400X100-21N]
U13  USB2412-DZK  [QFN28_5X5MC_MCH]
VR1  VARISTOR  [R0603]
VR2  VARISTOR  [R0603]
VR3  VARISTOR  [R0603]
VR4  VARISTOR  [R0603]
VR5  VARISTOR  [R0603]
VR6  VARISTOR  [R0603]
VR7  VARISTOR  [R0603]
VR8  VARISTOR  [R0603]
Y1  EPSON_TSX-3225_24.0000MF10Z-C3  [XTAL_EPSON_TSX3225]

### Nets
3V3_INSTR_MEAS [power]: 3V3.MEAS.TP C1.1 U1.OUT ; supply symbol labelled +3V3 ; also sheet 3
3V3_INSTR_PROC [power]: 3V3.IPROC.TP C2.1 C49.1 C50.1 C51.1 C52.1 C53.1 C54.1 JP.HUB.VDD.1 R44.2 R45.2 R49.2 R51.2 R52.2 U2.OUT U2.OUT_TAB(OUT) ; supply symbol labelled +3V3 ; also sheet 1
AGND [GND]: C1.2 R1.2 U1.GND ; also sheet 3
BAT_CHG_PROG1: R203.2 U12.13(PROG1)
CC3: J5.A5(_CONNECTOR:CC1) R42.2
CC4: J5.B5(_CONNECTOR:CC2) R43.2
CHG_VPCC [power]: R201.1 R202.2 U12.2(VPCC)
CM_DTR_V_SENSE_N: J_DBG_TO_MAIN_HDR.16 ; also sheet 3
CM_PROC_V_SENSE_N: J_DBG_TO_MAIN_HDR.14 ; also sheet 3
CM_STORAGE_V_SENSE_N: J_DBG_TO_MAIN_HDR.18 ; also sheet 3
CM_TEMP_V_SENSE_N: J_DBG_TO_MAIN_HDR.20 ; also sheet 3
DGND [GND]: C2.2 C3.2 C18.2 C46.2 C47.2 C48.2 C49.2 C50.2 C51.2 C52.2 C53.2 C54.2 C55.2 C56.2 C205.2 C208.2 D2.3(-) J1.3(GND) J1.5(GND) J5.A1(_CONNECTOR:GND) J5.A12(_CONNECTOR:GND1) J5.B1(_CONNECTOR:GND2) J5.B12(_CONNECTOR:GND3) J5.GND1(_SHIELD:SHIELD) J5.GND(_SHIELD:SHIELD) J5.Z1(_SHIELD:SHIELD) J5.Z2(_SHIELD:SHIELD) J5.Z3(_SHIELD:SHIELD) J5.Z4(_SHIELD:SHIELD) J5.Z5(_SHIELD:SHIELD) J5.Z6(_SHIELD:SHIELD) J19.2 J.USB.DBG.GND J.USB.DBG.S1(SHIELD) J.USB.DBG.S2(SHIELD) J.USB.DBG.S3(SHIELD) J.USB.DBG.S4(SHIELD) J.USB.MN.GND J.USB.MN.S1(SHIELD) J.USB.MN.S2(SHIELD) J.USB.MN.S3(SHIELD) J.USB.MN.S4(SHIELD) J_DBG_TO_MAIN_HDR.1 J_DBG_TO_MAIN_HDR.3 J_DBG_TO_MAIN_HDR.5 R1.1 R42.1 R43.1 R46.1 R48.1 R50.1 R202.1 R203.1 R204.1 R206.1 U2.GND U12.10(VSS) U12.11(VSS) U12.21(EP) U13.6(TEST) U13.15(TEST1) U13.29(EPAD) VR1.2 VR2.2 VR3.2 VR4.2 VR5.2 VR6.2 VR7.2 VR8.2 Y1.2(1_GND) Y1.4(2_GND) ; supply symbol labelled GND ; also sheet 1
EXT_VIN [power]: D1.A J19.1
HUB_INSTR_PROC_USB_D_N: JP.USB.DDN.3 U13.2(USBDM_DN2)
HUB_INSTR_PROC_USB_D_P: JP.USB.DDP.3 U13.3(USBDP_DN2)
HUB_MAIN_USB_DATA_N: JP.USB.MDN.3 U13.28(USBDM_DN1)
HUB_MAIN_USB_DATA_P: JP.USB.MDP.3 U13.1(USBDP_DN1)
HUB_USB_VBUS: R46.2 R47.1 U13.18(VBUS_DET)
INSTR_PROC_USB_D_N: JP.USB.DDN.2 ; also sheet 1
INSTR_PROC_USB_D_P: JP.USB.DDP.2 ; also sheet 1
MAIN_GPIO0: J_DBG_TO_MAIN_HDR.7 ; also sheet 1
MAIN_GPIO1: J_DBG_TO_MAIN_HDR.9 ; also sheet 1
MAIN_GPIO2: J_DBG_TO_MAIN_HDR.11 ; also sheet 1
MAIN_GPIO3: J_DBG_TO_MAIN_HDR.13 ; also sheet 1
MAIN_NRESET: J1.10(!RESET) J_DBG_TO_MAIN_HDR.30
MAIN_SWD_SWCLK: J1.4(SWDCLK/TCK) J_DBG_TO_MAIN_HDR.19
MAIN_SWD_SWDIO: J1.2(SWDIO/TMS) J_DBG_TO_MAIN_HDR.21
MAIN_TRACE_CLK/GPIO4: J_DBG_TO_MAIN_HDR.26 ; also sheet 1
MAIN_TRACE_D0/GPIO6: J_DBG_TO_MAIN_HDR.23 ; also sheet 1
MAIN_TRACE_D1/GPIO7: J_DBG_TO_MAIN_HDR.25 ; also sheet 1
MAIN_TRACE_D2/GPIO8: J_DBG_TO_MAIN_HDR.27
MAIN_TRACE_D3/GPIO9: J_DBG_TO_MAIN_HDR.29
MAIN_TRACE_SWO/GPIO5: J_DBG_TO_MAIN_HDR.28 ; also sheet 1
MAIN_USART_RX: J_DBG_TO_MAIN_HDR.17 ; also sheet 1
MAIN_USART_TX: J_DBG_TO_MAIN_HDR.15 JP.USB.USART.2 ; also sheet 1
MAIN_USB_DATA_N: J_DBG_TO_MAIN_HDR.22 JP.USB.MDN.2
MAIN_USB_DATA_P: J_DBG_TO_MAIN_HDR.24 JP.USB.MDP.2
N$1: JP.EN.VMEAS.2 U1.IN
N$4: JP.EN.VPROC.2 U2.IN
N$6 [power]: L1.2 S201.2(P)
N$8: F2.2 U12.14(VBAT) U12.15(VBAT) U12.16(VBAT_SENSE)
N$10: R204.2 U12.12(PROG3)
N$14: R45.1 U13.7(PRTPWR1)
N$15 [power]: D1.C JP.EXT.PWR.1
N$16: R44.1 U13.11(PRTPWR2)
THERM: R206.2 U12.5(THERM)
UCTX_DBGRX: J5.A8(_CONNECTOR:SBU1) J5.B8(_CONNECTOR:SBU2) JP.USB.USART.1
USB_BKUP_DBG_D_N: J.USB.DBG.D- JP.USB.DDN.1 VR5.1
USB_BKUP_DBG_D_P: J.USB.DBG.D+ JP.USB.DDP.1 VR2.1
USB_BKUP_DBG_OTGID: J.USB.DBG.USBID VR1.1
USB_BKUP_DBG_VBUS [power]: J.USB.DBG.VBUS JP.USB.DBG.2 JP.USB.VBUSP.1
USB_BKUP_MAIN_D_N: J.USB.MN.D- JP.USB.MDP.1 VR8.1
USB_BKUP_MAIN_D_P: J.USB.MN.D+ JP.USB.MDN.1 VR7.1
USB_BKUP_MAIN_OTGID: J.USB.MN.USBID VR6.1
USB_BKUP_MAIN_VBUS [power]: J.USB.MN.VBUS JP.USBC.2
USB_CONN_D_N: D2.2(AC1) J5.A6(_CONNECTOR:DP1) J5.B6(_CONNECTOR:DP2) L2.3 VR3.1
USB_CONN_D_P: D2.4(AC2) J5.A7(_CONNECTOR:DN1) J5.B7(_CONNECTOR:DN2) L2.2 VR4.1
USB_D_N: L2.4 U13.21(USBDM_UP)
USB_D_P: L2.1 U13.22(USBDP_UP)
USB_HS_IND: R50.2 U13.16(HS_IND)
USB_HUB_RST: C48.1 R49.1 U13.17(RESET_N)
USB_HUB_VDD [power]: JP.HUB.VDD.2 U13.4(VDD33_2) U13.10(VDD33_3) U13.14(VDD33_4) U13.20(VDD33_5) U13.27(VDD33)
USB_NONRMV0: R51.1 U13.19(SUSP_IND/NON_REM0)
USB_NONRMV1: R52.1 U13.13(NON_REMI)
USB_RBIAS: R48.2 U13.26(RBIAS)
USB_VBUS_IPROC [power]: JP.USB.VBUSP.2 ; also sheet 1
USB_XIN: C55.1 R7.2 U13.24(XTALIN/CLKIN) Y1.1
USB_XOUT: C56.1 R7.1 U13.23(XTALOUT) Y1.3
USBC_VBUS [power]: C46.1 C47.1 D2.1(+) J5.A4(_CONNECTOR:VBUS) J5.A9(_CONNECTOR:VBUS1) J5.B4(_CONNECTOR:VBUS2) J5.B9(_CONNECTOR:VBUS3) JP.USB.VBUSP.3 JP.USBC.VBUS.1 R47.2
V_BATT_MAIN [power]: J_DBG_TO_MAIN_HDR.6 J_DBG_TO_MAIN_HDR.8 J_DBG_TO_MAIN_HDR.10 JP.CHRG.MAIN.2
V_SENSE_P: J1.1(VCC) J_DBG_TO_MAIN_HDR.12 ; also sheet 3
VCHRG_BATT [power]: C18.1 F2.1 JP.CHRG.MAIN.1
VCHRG_OUT [power]: C208.1 JP.VREG.SEL.3 U12.1(OUT) U12.20(OUT)
VDD_TO_MAIN [power]: J_DBG_TO_MAIN_HDR.2 J_DBG_TO_MAIN_HDR.4 JP.VDD.MAIN.2
VREG_IN [power]: C3.1 C205.1 JP.EN.VMEAS.1 JP.EN.VPROC.1 JP.VDD.MAIN.1 JP.VREG.SEL.2
VSRC [power]: JP.EXT.PWR.2 JP.USB.DBG.1 JP.USBC.1 JP.USBC.VBUS.2 L1.1
VSRC_RAW [power]: JP.VREG.SEL.1 R201.2 S201.3(S) U12.3(SEL) U12.4(PROG2) U12.9(!TE) U12.17(CE) U12.18(IN) U12.19(IN)
Unconnected: J1.6(SWO/TDO) J1.7(KEY) J1.8(NC/TDI) J1.9(GNDDTCT) J5.A2(_CONNECTOR:SSTXP1) J5.A3(_CONNECTOR:SSTXN1) J5.A10(_CONNECTOR:SSRXN2) J5.A11(_CONNECTOR:SSRXP2) J5.B2(_CONNECTOR:SSTXP2) J5.B3(_CONNECTOR:SSTXN2) J5.B10(_CONNECTOR:SSRXN1) J5.B11(_CONNECTOR:SSRXP1) S201.1(O) U12.6(!PG) U12.7(STAT2) U12.8(STAT1/!LBO) U13.5(NC) U13.8(OCS_N1) U13.9(CRFILT) U13.12(OCS_N2) U13.25(PLLFILT)

### Buses
MAIN_DATA_SIGNALS:MAIN_GPIO0,MAIN_GPIO1,MAIN_GPIO2,MAIN_GPIO3,MAIN_TRACE_CLK/GPIO4,MAIN_TRACE_D0/GPIO6,MAIN_TRACE_D1/GPIO7,MAIN_TRACE_D2/GPIO8,MAIN_TRACE_D3/GPIO9,MAIN_TRACE_SWO/GPIO5,MAIN_USART_RX,MAIN_USART_TX,MAIN_USB_DATA_N,MAIN_USB_DATA_P
JTAG:INSTR_PROC_JTAG_TCK/SWCLK,INSTR_PROC_JTAG_TDI,INSTR_PROC_JTAG_TDO/SWO,INSTR_PROC_JTAG_TMS/SWDIO,INSTR_PROC_NRESET,MAIN_NRESET,MAIN_SWD_SWCLK,MAIN_SWD_SWDIO,MAIN_TRACE_CLK/GPIO4,MAIN_TRACE_D0/GPIO6,MAIN_TRACE_D1/GPIO7,MAIN_TRACE_D2/GPIO8,MAIN_TRACE_D3/GPIO9,MAIN_TRACE_SWO/GPIO5
POWER:3V3_INSTR_PROC,AGND,DGND,EXT_VIN,USB_VBUS,V_BATT_MAIN,VBUS,VCHRG_BATT,VDD_TO_MAIN,VSRC_RAW
POWER_SENSING:CM_DTR_DCBIAS_SHUTDOWN,CM_DTR_DIFFAMP_GAIN0,CM_DTR_DIFFAMP_GAIN1,CM_DTR_DIFFAMP_N3,CM_DTR_DIFFAMP_OUT,CM_DTR_DIFFAMP_P3,CM_DTR_OPAMP_ENABLE3,CM_DTR_OPAMP_N3,CM_DTR_OPAMP_OUT3,CM_DTR_OPAMP_P3,CM_DTR_V_OFFSET_IN,CM_DTR_V_SENSE_N,CM_DTR_V_SENSE_P,CM_PROC_DCBIAS_SHUTDOWN,CM_PROC_DIFFAMP_GAIN0,CM_PROC_DIFFAMP_GAIN1,CM_PROC_DIFFAMP_N1,CM_PROC_DIFFAMP_OUT,CM_PROC_DIFFAMP_P1,CM_PROC_OPAMP_ENABLE1,CM_PROC_OPAMP_N1,CM_PROC_OPAMP_OUT1,CM__PROCOPAMP_P1,CM_PROC_V_OFFSET_IN,CM_PROC_V_SENSE_N,CM_PROC_V_SENSE_P,CM_STORAGE_DCBIAS_SHUTDOWN,CM_STORAGE_DIFFAMP_GAIN0,CM_STORAGE_DIFFAMP_GAIN1,CM_STORAGE_DIFFAMP_N1,CM_STORAGE_DIFFAMP_OUT,CM_STORAGE_DIFFAMP_P1,CM_STORAGE_OPAMP_ENABLE1,CM_STORAGE_OPAMP_N1,CM_STORAGE_OPAMP_OUT1,CM_STORAGE_OPAMP_P1,CM_STORAGE_V_OFFSET_IN,CM_STORAGE_V_SENSE_N,CM_STORAGE_V_SENSE_P,CM_TEMP_DCBIAS_SHUTDOWN,CM_TEMP_DIFFAMP_GAIN0,CM_TEMP_DIFFAMP_GAIN1,CM_TEMP_DIFFAMP_N1,CM_TEMP_DIFFAMP_OUT,CM_TEMP_DIFFAMP_P1,CM_TEMP_OPAMP_ENABLE1,CM_TEMP_OPAMP_N1,CM_TEMP_OPAMP_OUT1,CM_TEMP_OPAMP_P1,CM_TEMP_V_OFFSET_IN,CM_TEMP_V_SENSE_N,CM_TEMP_V_SENSE_P,V_SENSE_P
USB:HUB_INSTR_PROC_USB_D_N,HUB_INSTR_PROC_USB_D_P,HUB_MAIN_USB_DATA_N,HUB_MAIN_USB_DATA_P,INSTR_PROC_USB_D_N,INSTR_PROC_USB_D_P,MAIN_USB_DATA_N,MAIN_USB_DATA_P,USB_BKUP_DBG_D_N,USB_BKUP_DBG_D_P,USB_BKUP_DBG_OTGID,USB_BKUP_DBG_VBUS,USB_BKUP_MAIN_D_N,USB_BKUP_MAIN_D_P,USB_BKUP_MAIN_OTGID,USB_BKUP_MAIN_VBUS,USBC_VBUS,USB_D_N,USB_D_P,USB_VBUS,USB_VBUS_IPROC,VBUS

### Notes on the sheet
- Extra Power Source (Solar)
- USB Micro Connectors
  (backup for hub)
- Connection questionable
- ESD protection
- USB Type-C Connector
- Add DLP11SN900SL2 and BGX50A
- Power switch
- GND Bridge
- All analog signals should be
  routed between the GND domains
  underneath this resistor
- 5x2 0.05'' JTAG connector (Main)
- pullups are present on main board
- USB Hub/Switch
- pull-up for power pins; 
  hub should not shutdown
   other devices
- Floating bc 
  internal pull-ups
- Debug to Main
  board connector
- Regulators
- Battery Charger
- Trace signals may be reused as GPIOs; 
  they require a special debugger, 
  but allow in-depth debugging

## Sheet 3 of 3
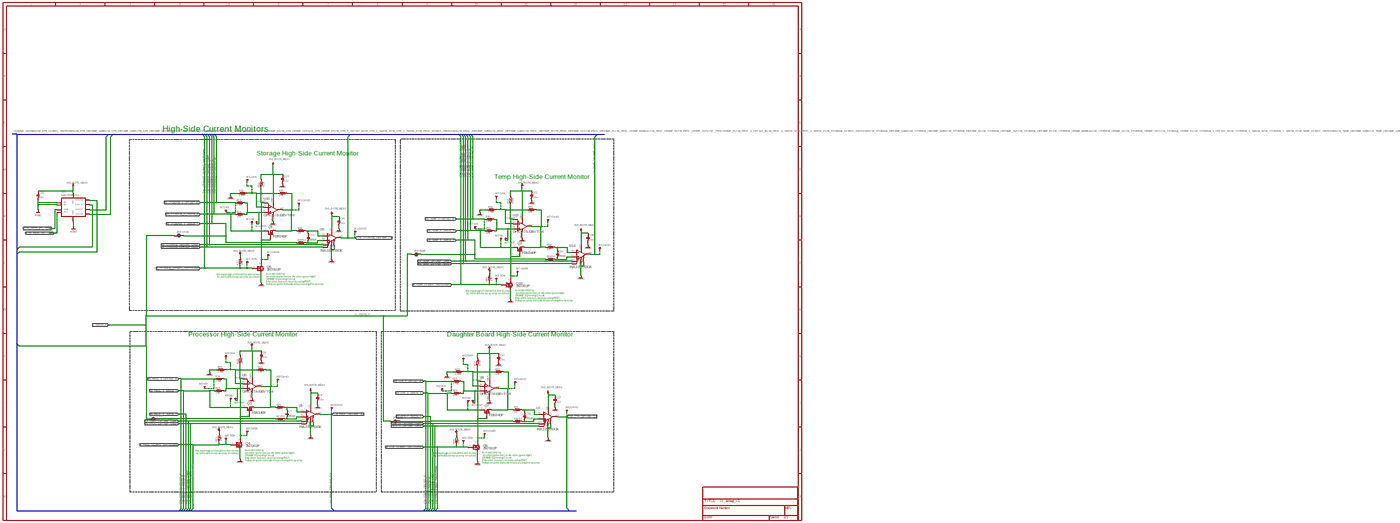
[diagram p4: schematic, sheet 3, overview]
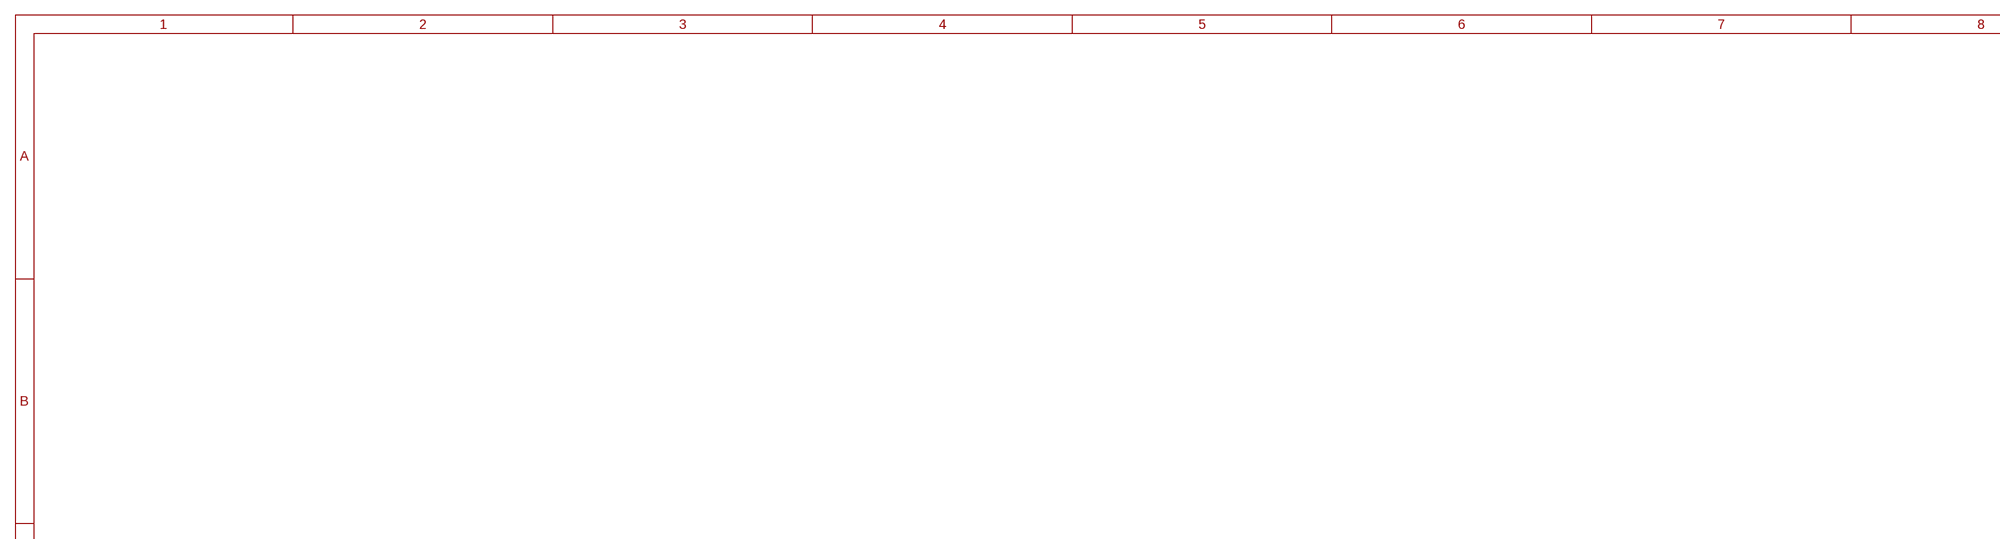
[diagram p5: schematic, sheet 3, part 1 of 4]
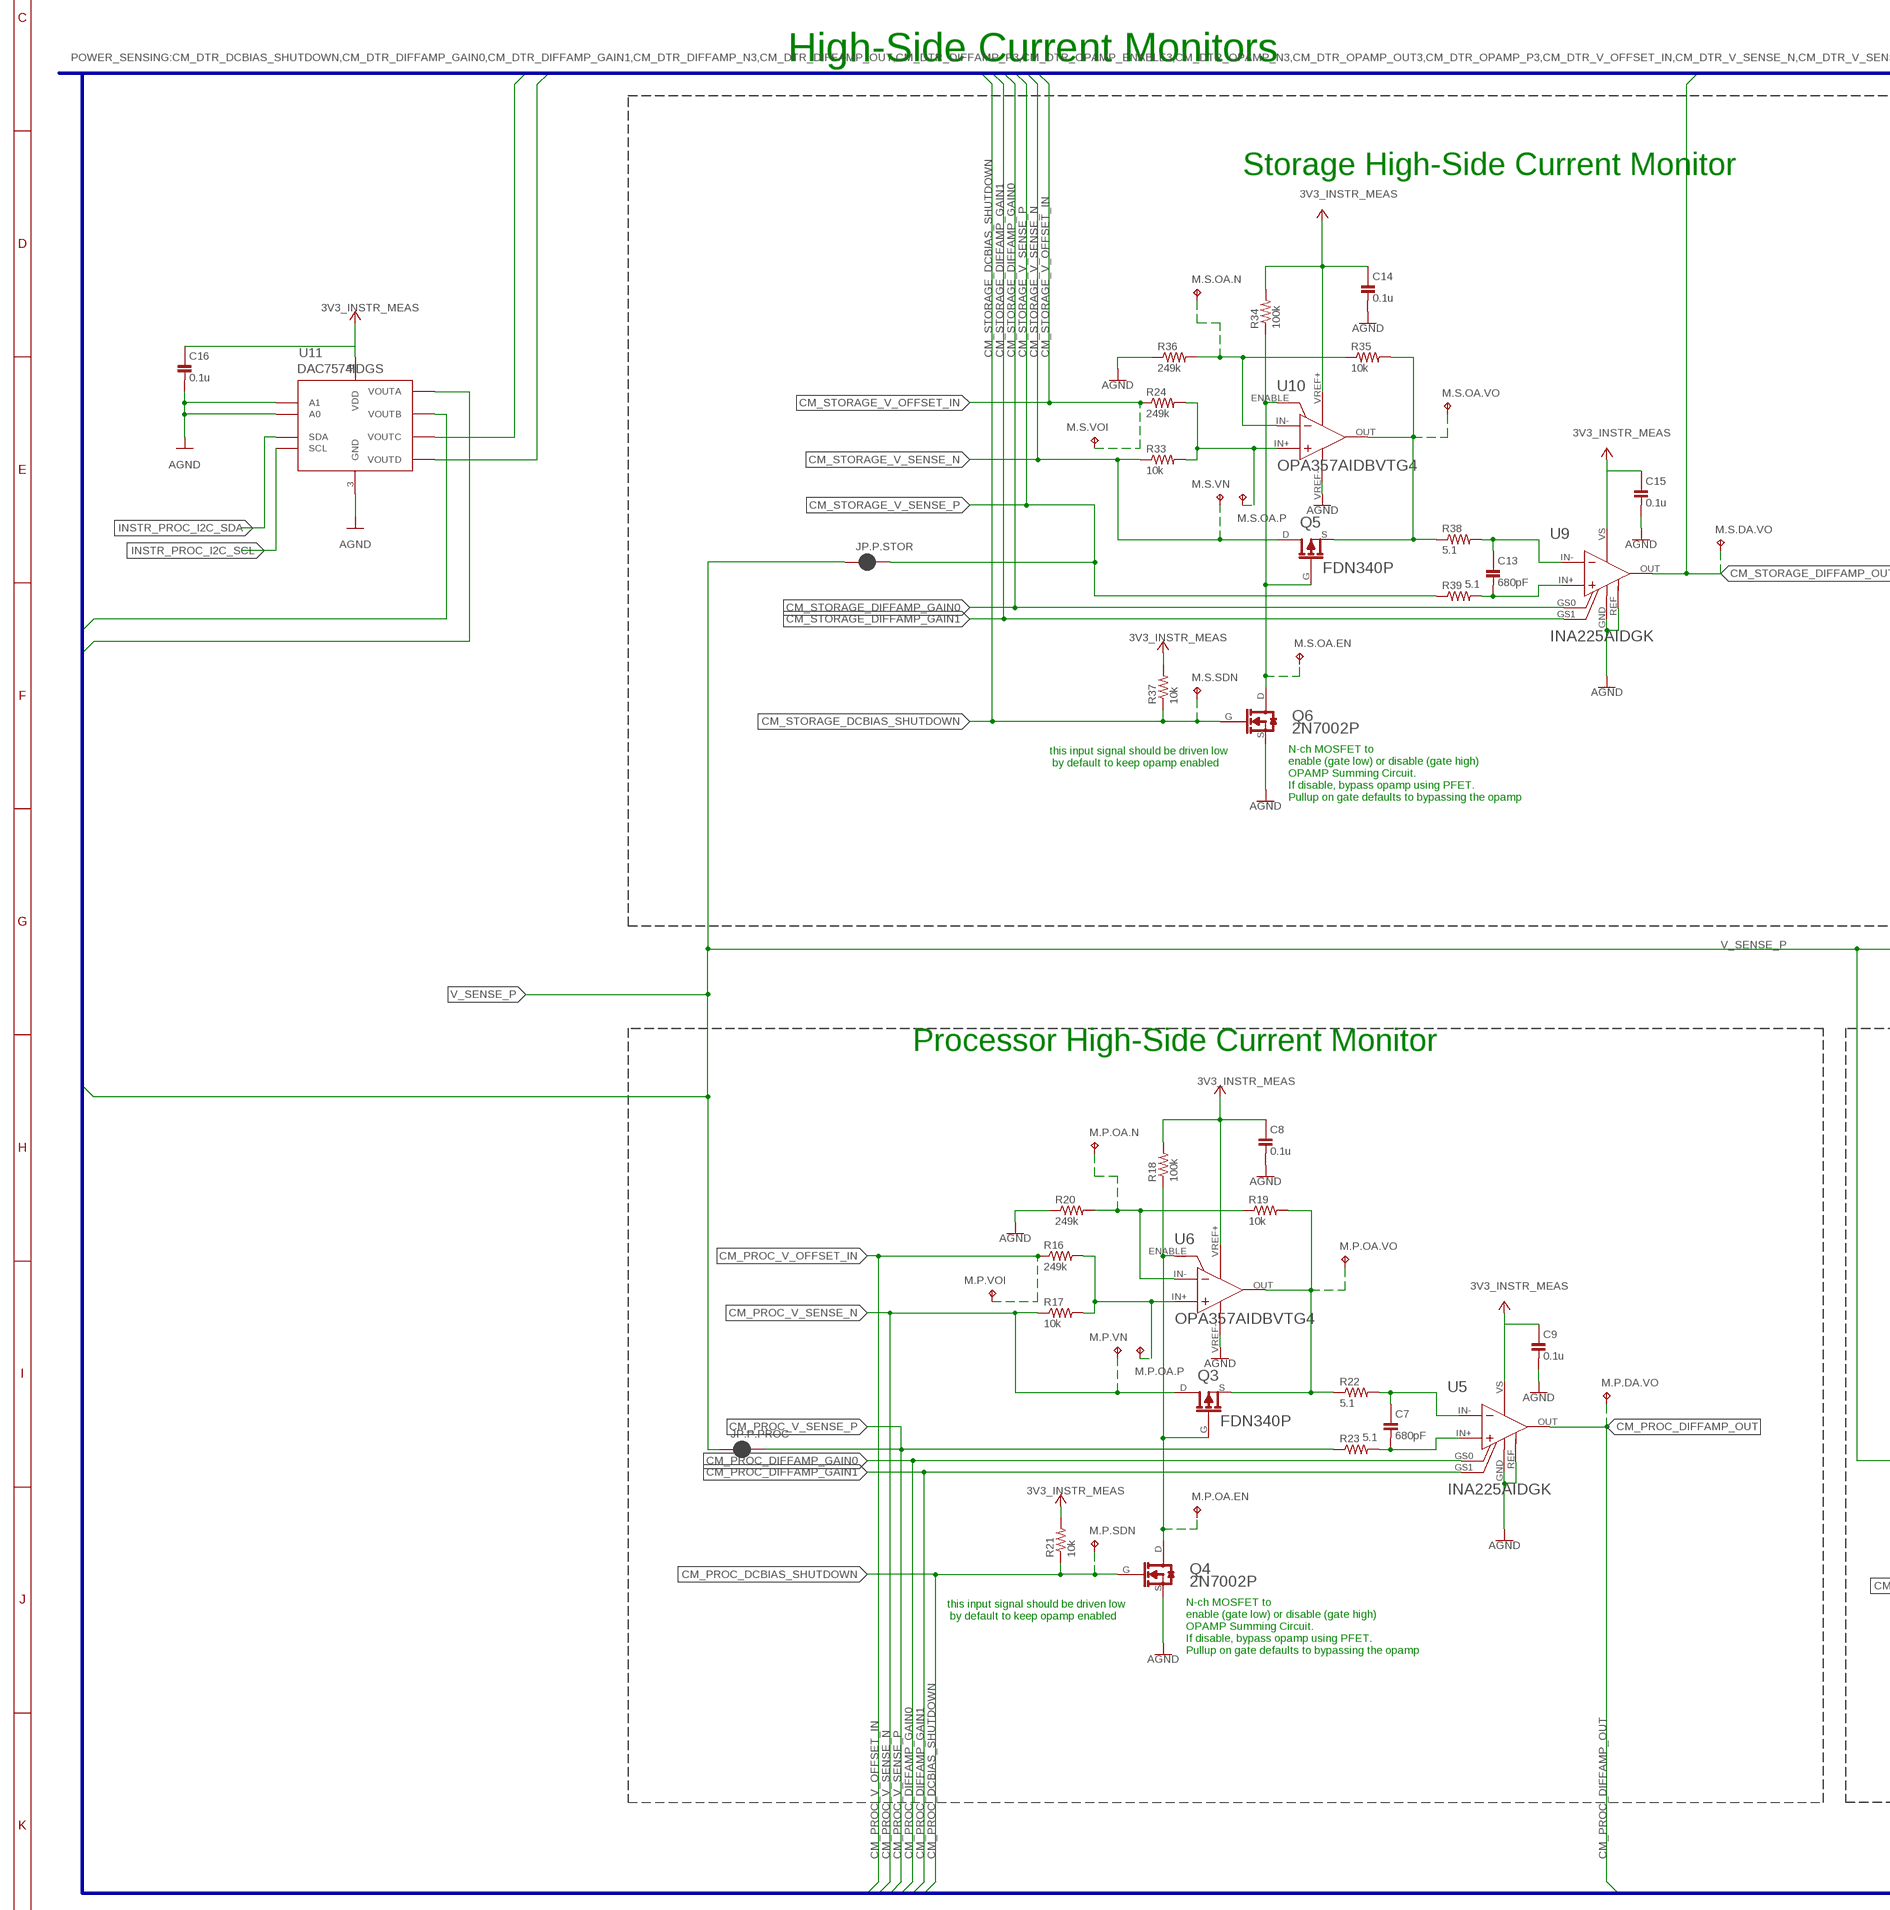
[diagram p6: schematic, sheet 3, part 2 of 4]
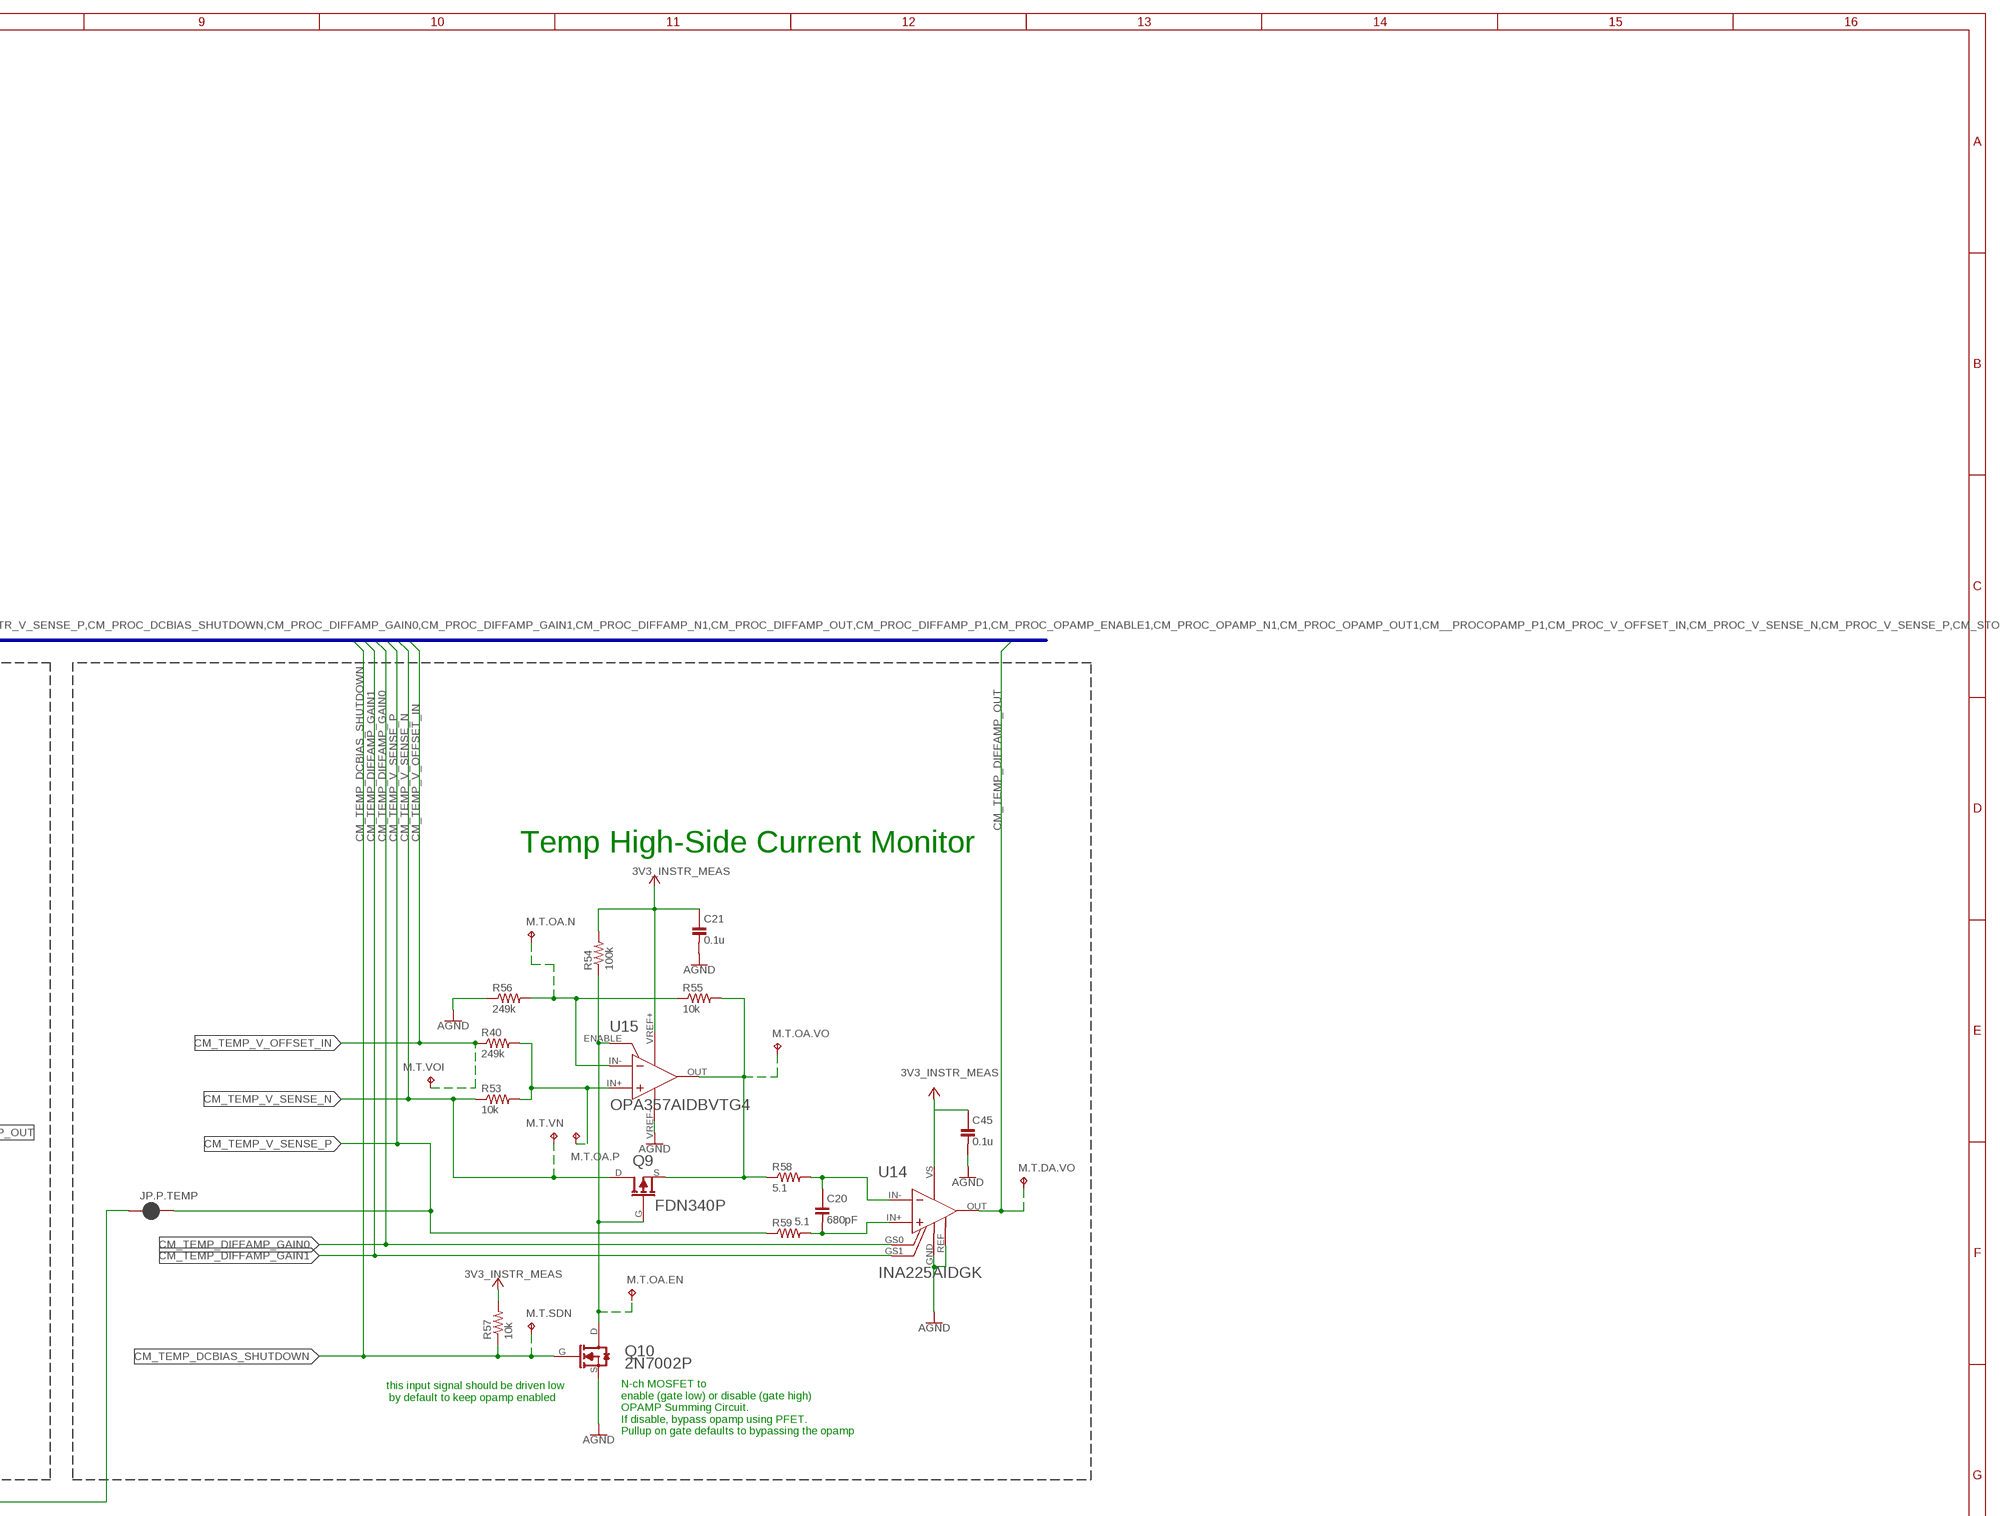
[diagram p7: schematic, sheet 3, part 3 of 4]
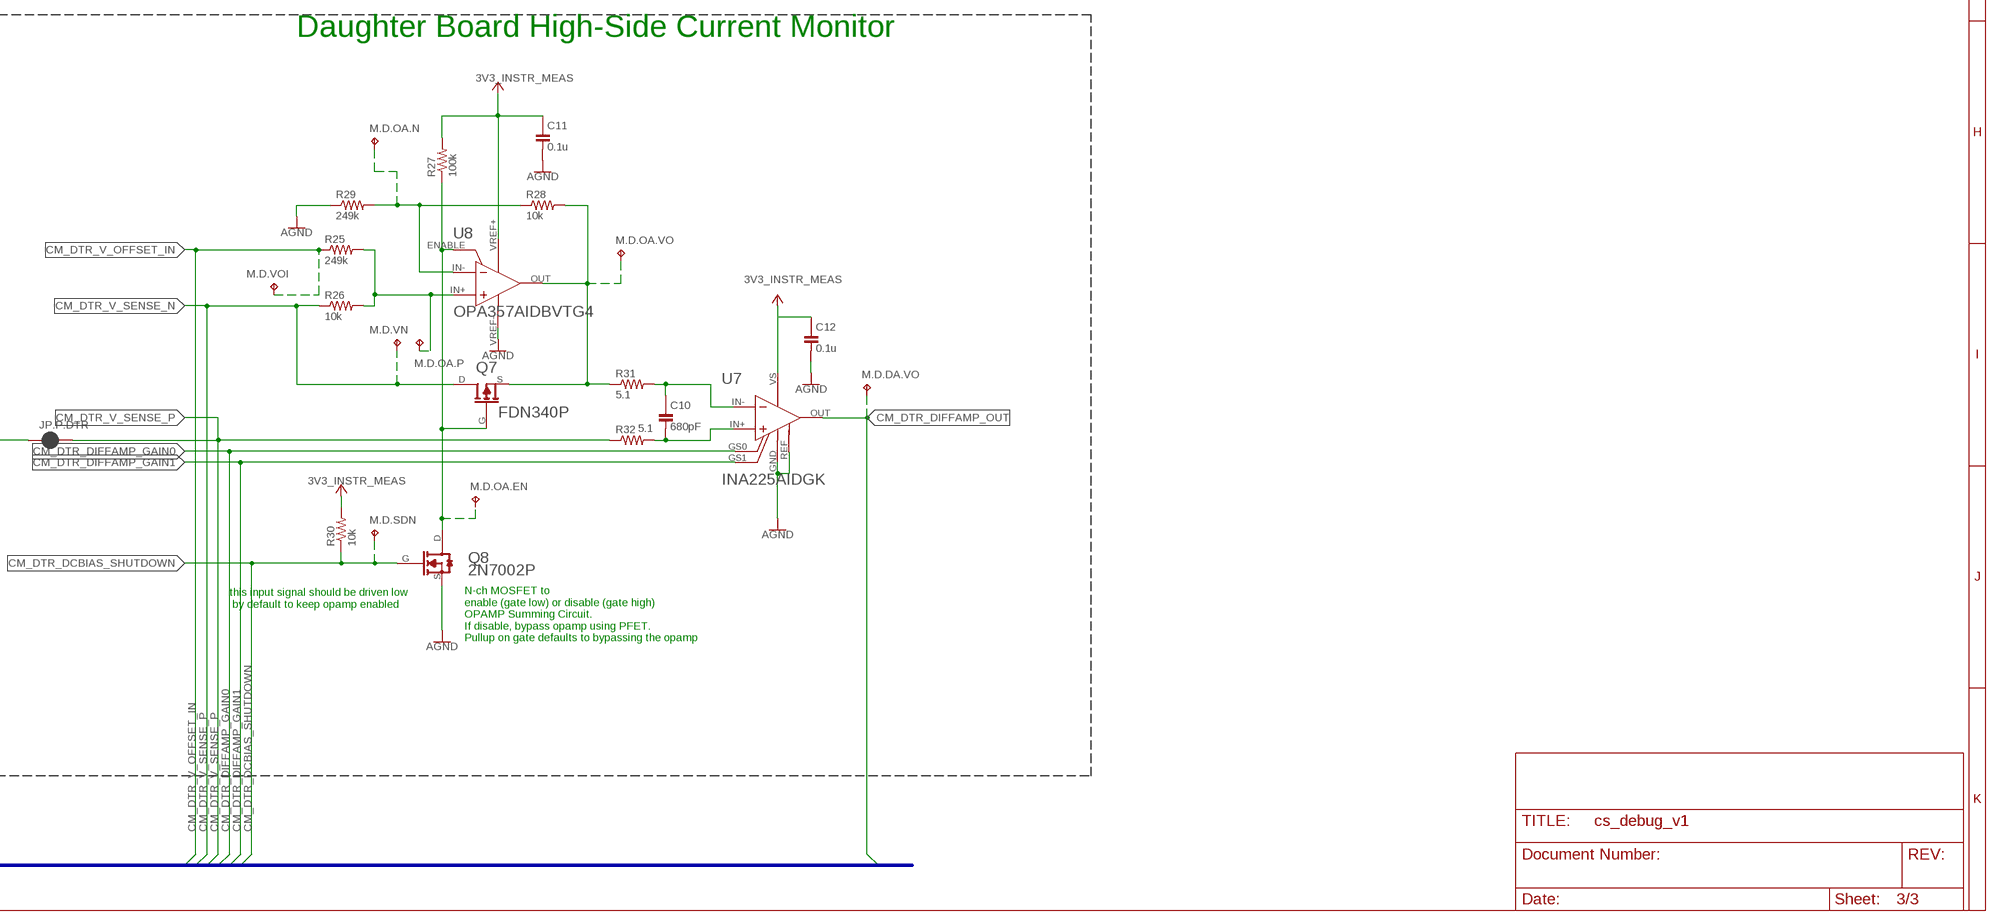
[diagram p8: schematic, sheet 3, part 4 of 4]

### Parts
C7  680pF  C-0402  [C0402]
C8  0.1u  C-0402  [C0402]
C9  0.1u  C-0402  [C0402]
C10  680pF  C-0402  [C0402]
C11  0.1u  C-0402  [C0402]
C12  0.1u  C-0402  [C0402]
C13  680pF  C-0402  [C0402]
C14  0.1u  C-0402  [C0402]
C15  0.1u  C-0402  [C0402]
C16  0.1u  C-0402  [C0402]
C20  680pF  C-0402  [C0402]
C21  0.1u  C-0402  [C0402]
C45  0.1u  C-0402  [C0402]
JP.P.DTR  JUMPER-SMT_2_NC_PASTE_NO-SILK  [SMT-JUMPER_2_NC_PASTE_NO-SILK]
JP.P.PROC  JUMPER-SMT_2_NC_PASTE_NO-SILK  [SMT-JUMPER_2_NC_PASTE_NO-SILK]
JP.P.STOR  JUMPER-SMT_2_NC_PASTE_NO-SILK  [SMT-JUMPER_2_NC_PASTE_NO-SILK]
JP.P.TEMP  JUMPER-SMT_2_NC_PASTE_NO-SILK  [SMT-JUMPER_2_NC_PASTE_NO-SILK]
M.D.DA.VO  TPTP10SQ  [TP10SQ]
M.D.OA.EN  TPTP10SQ  [TP10SQ]
M.D.OA.N  TPTP10SQ  [TP10SQ]
M.D.OA.P  TPTP10SQ  [TP10SQ]
M.D.OA.VO  TPTP10SQ  [TP10SQ]
M.D.SDN  TPTP10SQ  [TP10SQ]
M.D.VN  TPTP10SQ  [TP10SQ]
M.D.VOI  TPTP10SQ  [TP10SQ]
M.P.DA.VO  TPTP10SQ  [TP10SQ]
M.P.OA.EN  TPTP10SQ  [TP10SQ]
M.P.OA.N  TPTP10SQ  [TP10SQ]
M.P.OA.P  TPTP10SQ  [TP10SQ]
M.P.OA.VO  TPTP10SQ  [TP10SQ]
M.P.SDN  TPTP10SQ  [TP10SQ]
M.P.VN  TPTP10SQ  [TP10SQ]
M.P.VOI  TPTP10SQ  [TP10SQ]
M.S.DA.VO  TPTP10SQ  [TP10SQ]
M.S.OA.EN  TPTP10SQ  [TP10SQ]
M.S.OA.N  TPTP10SQ  [TP10SQ]
M.S.OA.P  TPTP10SQ  [TP10SQ]
M.S.OA.VO  TPTP10SQ  [TP10SQ]
M.S.SDN  TPTP10SQ  [TP10SQ]
M.S.VN  TPTP10SQ  [TP10SQ]
M.S.VOI  TPTP10SQ  [TP10SQ]
M.T.DA.VO  TPTP10SQ  [TP10SQ]
M.T.OA.EN  TPTP10SQ  [TP10SQ]
M.T.OA.N  TPTP10SQ  [TP10SQ]
M.T.OA.P  TPTP10SQ  [TP10SQ]
M.T.OA.VO  TPTP10SQ  [TP10SQ]
M.T.SDN  TPTP10SQ  [TP10SQ]
M.T.VN  TPTP10SQ  [TP10SQ]
M.T.VOI  TPTP10SQ  [TP10SQ]
Q3  FDN340P  [SOT23-3_FDN340P]
Q4  2N7002P  [SOT23-3_2N7002P]
Q5  FDN340P  [SOT23-3_FDN340P]
Q6  2N7002P  [SOT23-3_2N7002P]
Q7  FDN340P  [SOT23-3_FDN340P]
Q8  2N7002P  [SOT23-3_2N7002P]
Q9  FDN340P  [SOT23-3_FDN340P]
Q10  2N7002P  [SOT23-3_2N7002P]
R16  249k  R-0402  [R0402]
R17  10k  R-0402  [R0402]
R18  100k  R-0402  [R0402]
R19  10k  R-0402  [R0402]
R20  249k  R-0402  [R0402]
R21  10k  R-0402  [R0402]
R22  5.1  R-0603  [R0603]
R23  5.1  R-0603  [R0603]
R24  249k  R-0402  [R0402]
R25  249k  R-0402  [R0402]
R26  10k  R-0402  [R0402]
R27  100k  R-0402  [R0402]
R28  10k  R-0402  [R0402]
R29  249k  R-0402  [R0402]
R30  10k  R-0402  [R0402]
R31  5.1  R-0603  [R0603]
R32  5.1  R-0603  [R0603]
R33  10k  R-0402  [R0402]
R34  100k  R-0402  [R0402]
R35  10k  R-0402  [R0402]
R36  249k  R-0402  [R0402]
R37  10k  R-0402  [R0402]
R38  5.1  R-0603  [R0603]
R39  5.1  R-0603  [R0603]
R40  249k  R-0402  [R0402]
R53  10k  R-0402  [R0402]
R54  100k  R-0402  [R0402]
R55  10k  R-0402  [R0402]
R56  249k  R-0402  [R0402]
R57  10k  R-0402  [R0402]
R58  5.1  R-0603  [R0603]
R59  5.1  R-0603  [R0603]
U5  INA225AIDGK  [DGK-MSOP8_INA225]
U6  OPA357AIDBVTG4  [OPA357AIDBVTG4]
U7  INA225AIDGK  [DGK-MSOP8_INA225]
U8  OPA357AIDBVTG4  [OPA357AIDBVTG4]
U9  INA225AIDGK  [DGK-MSOP8_INA225]
U10  OPA357AIDBVTG4  [OPA357AIDBVTG4]
U11  DAC7574IDGS  [DGS10]
U14  INA225AIDGK  [DGK-MSOP8_INA225]
U15  OPA357AIDBVTG4  [OPA357AIDBVTG4]

### Nets
3V3_INSTR_MEAS [power]: C8.1 C9.1 C11.1 C12.1 C14.1 C15.1 C16.1 C21.1 C45.1 R18.2 R21.2 R27.2 R30.2 R34.2 R37.2 R54.2 R57.2 U5.VS(V+) U6.VREF+(V+) U7.VS(V+) U8.VREF+(V+) U9.VS(V+) U10.VREF+(V+) U11.8(VDD) U14.VS(V+) U15.VREF+(V+) ; supply symbol labelled +3V3 ; also sheet 2
AGND [GND]: C8.2 C9.2 C11.2 C12.2 C14.2 C15.2 C16.2 C21.2 C45.2 Q4.S(SOURCE) Q6.S(SOURCE) Q8.S(SOURCE) Q10.S(SOURCE) R20.1 R29.1 R36.1 R56.1 U5.GND(V-) U5.REF U6.VREF-(V-) U7.GND(V-) U7.REF U8.VREF-(V-) U9.GND(V-) U9.REF U10.VREF-(V-) U11.3(GND) U11.9(A0) U11.10(A1) U14.GND(V-) U14.REF U15.VREF-(V-) ; also sheet 2
CM_DIFFAMP_N1: C20.1 R58.2 U14.IN-
CM_DIFFAMP_N2: C13.1 R38.2 U9.IN-
CM_DIFFAMP_N3: C10.1 R31.2 U7.IN-
CM_DIFFAMP_N4: C7.1 R22.2 U5.IN-
CM_DIFFAMP_P1: C20.2 R59.2 U14.IN+
CM_DIFFAMP_P2: C13.2 R39.2 U9.IN+
CM_DIFFAMP_P3: C10.2 R32.2 U7.IN+
CM_DIFFAMP_P4: C7.2 R23.2 U5.IN+
CM_DTR_DCBIAS_SHUTDOWN: M.D.SDN.TP Q8.G(GATE) R30.1 ; also sheet 1
CM_DTR_DIFFAMP_GAIN0: U7.GS0 ; also sheet 1
CM_DTR_DIFFAMP_GAIN1: U7.GS1 ; also sheet 1
CM_DTR_DIFFAMP_OUT: M.D.DA.VO.TP U7.OUT ; also sheet 1
CM_DTR_V_OFFSET_IN: M.D.VOI.TP R25.1 U11.2(VOUTB)
CM_DTR_V_SENSE_N: M.D.VN.TP Q7.D R26.1 ; also sheet 2
CM_DTR_V_SENSE_P: JP.P.DTR.2 R32.1
CM_OPAMP_ENABLE1: M.T.OA.EN.TP Q9.G Q10.D(DRAIN) R54.1 U15.ENABLE
CM_OPAMP_ENABLE2: M.S.OA.EN.TP Q5.G Q6.D(DRAIN) R34.1 U10.ENABLE
CM_OPAMP_ENABLE3: M.D.OA.EN.TP Q7.G Q8.D(DRAIN) R27.1 U8.ENABLE
CM_OPAMP_ENABLE4: M.P.OA.EN.TP Q3.G Q4.D(DRAIN) R18.1 U6.ENABLE
CM_OPAMP_N1: M.T.OA.N.TP R55.1 R56.2 U15.IN-
CM_OPAMP_N2: M.S.OA.N.TP R35.1 R36.2 U10.IN-
CM_OPAMP_N3: M.D.OA.N.TP R28.1 R29.2 U8.IN-
CM_OPAMP_N4: M.P.OA.N.TP R19.1 R20.2 U6.IN-
CM_OPAMP_OUT1: M.T.OA.VO.TP Q9.S R55.2 R58.1 U15.OUT
CM_OPAMP_OUT2: M.S.OA.VO.TP Q5.S R35.2 R38.1 U10.OUT
CM_OPAMP_OUT3: M.D.OA.VO.TP Q7.S R28.2 R31.1 U8.OUT
CM_OPAMP_OUT4: M.P.OA.VO.TP Q3.S R19.2 R22.1 U6.OUT
CM_OPAMP_P1: M.T.OA.P.TP R40.2 R53.2 U15.IN+
CM_OPAMP_P2: M.S.OA.P.TP R24.2 R33.2 U10.IN+
CM_OPAMP_P3: M.D.OA.P.TP R25.2 R26.2 U8.IN+
CM_OPAMP_P4: M.P.OA.P.TP R16.2 R17.2 U6.IN+
CM_PROC_DCBIAS_SHUTDOWN: M.P.SDN.TP Q4.G(GATE) R21.1 ; also sheet 1
CM_PROC_DIFFAMP_GAIN0: U5.GS0 ; also sheet 1
CM_PROC_DIFFAMP_GAIN1: U5.GS1 ; also sheet 1
CM_PROC_DIFFAMP_OUT: M.P.DA.VO.TP U5.OUT ; also sheet 1
CM_PROC_V_OFFSET_IN: M.P.VOI.TP R16.1 U11.1(VOUTA)
CM_PROC_V_SENSE_N: M.P.VN.TP Q3.D R17.1 ; also sheet 2
CM_PROC_V_SENSE_P: JP.P.PROC.2 R23.1
CM_STORAGE_DCBIAS_SHUTDOWN: M.S.SDN.TP Q6.G(GATE) R37.1 ; also sheet 1
CM_STORAGE_DIFFAMP_GAIN0: U9.GS0 ; also sheet 1
CM_STORAGE_DIFFAMP_GAIN1: U9.GS1 ; also sheet 1
CM_STORAGE_DIFFAMP_OUT: M.S.DA.VO.TP U9.OUT ; also sheet 1
CM_STORAGE_V_OFFSET_IN: M.S.VOI.TP R24.1 U11.4(VOUTC)
CM_STORAGE_V_SENSE_N: M.S.VN.TP Q5.D R33.1 ; also sheet 2
CM_STORAGE_V_SENSE_P: JP.P.STOR.2 R39.1
CM_TEMP_DCBIAS_SHUTDOWN: M.T.SDN.TP Q10.G(GATE) R57.1 ; also sheet 1
CM_TEMP_DIFFAMP_GAIN0: U14.GS0 ; also sheet 1
CM_TEMP_DIFFAMP_GAIN1: U14.GS1 ; also sheet 1
CM_TEMP_DIFFAMP_OUT: M.T.DA.VO.TP U14.OUT ; also sheet 1
CM_TEMP_V_OFFSET_IN: M.T.VOI.TP R40.1 U11.5(VOUTD)
CM_TEMP_V_SENSE_N: M.T.VN.TP Q9.D R53.1 ; also sheet 2
CM_TEMP_V_SENSE_P: JP.P.TEMP.2 R59.1
INSTR_PROC_I2C_SCL: U11.6(SCL) ; also sheet 1
INSTR_PROC_I2C_SDA: U11.7(SDA) ; also sheet 1
V_SENSE_P: JP.P.DTR.1 JP.P.PROC.1 JP.P.STOR.1 JP.P.TEMP.1 ; also sheet 2

### Buses
POWER_SENSING:CM_DTR_DCBIAS_SHUTDOWN,CM_DTR_DIFFAMP_GAIN0,CM_DTR_DIFFAMP_GAIN1,CM_DTR_DIFFAMP_N3,CM_DTR_DIFFAMP_OUT,CM_DTR_DIFFAMP_P3,CM_DTR_OPAMP_ENABLE3,CM_DTR_OPAMP_N3,CM_DTR_OPAMP_OUT3,CM_DTR_OPAMP_P3,CM_DTR_V_OFFSET_IN,CM_DTR_V_SENSE_N,CM_DTR_V_SENSE_P,CM_PROC_DCBIAS_SHUTDOWN,CM_PROC_DIFFAMP_GAIN0,CM_PROC_DIFFAMP_GAIN1,CM_PROC_DIFFAMP_N1,CM_PROC_DIFFAMP_OUT,CM_PROC_DIFFAMP_P1,CM_PROC_OPAMP_ENABLE1,CM_PROC_OPAMP_N1,CM_PROC_OPAMP_OUT1,CM__PROCOPAMP_P1,CM_PROC_V_OFFSET_IN,CM_PROC_V_SENSE_N,CM_PROC_V_SENSE_P,CM_STORAGE_DCBIAS_SHUTDOWN,CM_STORAGE_DIFFAMP_GAIN0,CM_STORAGE_DIFFAMP_GAIN1,CM_STORAGE_DIFFAMP_N1,CM_STORAGE_DIFFAMP_OUT,CM_STORAGE_DIFFAMP_P1,CM_STORAGE_OPAMP_ENABLE1,CM_STORAGE_OPAMP_N1,CM_STORAGE_OPAMP_OUT1,CM_STORAGE_OPAMP_P1,CM_STORAGE_V_OFFSET_IN,CM_STORAGE_V_SENSE_N,CM_STORAGE_V_SENSE_P,CM_TEMP_DCBIAS_SHUTDOWN,CM_TEMP_DIFFAMP_GAIN0,CM_TEMP_DIFFAMP_GAIN1,CM_TEMP_DIFFAMP_N1,CM_TEMP_DIFFAMP_OUT,CM_TEMP_DIFFAMP_P1,CM_TEMP_OPAMP_ENABLE1,CM_TEMP_OPAMP_N1,CM_TEMP_OPAMP_OUT1,CM_TEMP_OPAMP_P1,CM_TEMP_V_OFFSET_IN,CM_TEMP_V_SENSE_N,CM_TEMP_V_SENSE_P,V_SENSE_P

### Notes on the sheet
- High-Side Current Monitors
- Storage High-Side Current Monitor
- Temp High-Side Current Monitor
- this input signal should be driven low
   by default to keep opamp enabled
- N-ch MOSFET to 
  enable (gate low) or disable (gate high)
  OPAMP Summing Circuit.
  If disable, bypass opamp using PFET.
  Pullup on gate defaults to bypassing the opamp
- this input signal should be driven low
   by default to keep opamp enabled
- N-ch MOSFET to 
  enable (gate low) or disable (gate high)
  OPAMP Summing Circuit.
  If disable, bypass opamp using PFET.
  Pullup on gate defaults to bypassing the opamp
- Processor High-Side Current Monitor | Daughter Board High-Side Current Monitor
- this input signal should be driven low
   by default to keep opamp enabled
- this input signal should be driven low
   by default to keep opamp enabled
- N-ch MOSFET to 
  enable (gate low) or disable (gate high)
  OPAMP Summing Circuit.
  If disable, bypass opamp using PFET.
  Pullup on gate defaults to bypassing the opamp
- N-ch MOSFET to 
  enable (gate low) or disable (gate high)
  OPAMP Summing Circuit.
  If disable, bypass opamp using PFET.
  Pullup on gate defaults to bypassing the opamp

## Library data of the parts
3V3.IPROC 3V3.MEAS M.D.DA.VO M.D.OA.EN M.D.OA.N M.D.OA.P M.D.OA.VO M.D.SDN M.D.VN M.D.VOI M.P.DA.VO M.P.OA.EN M.P.OA.N M.P.OA.P M.P.OA.VO M.P.SDN M.P.VN M.P.VOI M.S.DA.VO M.S.OA.EN M.S.OA.N M.S.OA.P M.S.OA.VO M.S.SDN M.S.VN M.S.VOI M.T.DA.VO M.T.OA.EN M.T.OA.N M.T.OA.P M.T.OA.VO M.T.SDN M.T.VN M.T.VOI SCL SDA = TestPoints:TP: Test pad
C1 C2 = Capacitors:C-: Capacitor, Surface Mount; MANUFACTURER: Kemet; MPN: C0805C106M8RACTU; PART_NO: C0805C106M8RACTU; TC: X7R; TOL: 10%; VOLTAGE: 10V
C3 C8 C9 C11 C12 C14-C16 C21 C22 C29-C45 C48-C53 = Capacitors:C-: Capacitor, Surface Mount; MANUFACTURER: Kemet; MPN: C0402C104K8RACTU; PART_NO: C0402C104K8RACTU; TC: X7R; TOL: 10%; VOLTAGE: 10V
C7 C10 C13 C20 = Capacitors:C-: Capacitor, Surface Mount; MANUFACTURER: Kemet; MPN: C0402C681K8RAC7867; PART_NO: C0402C681K8RAC7867; TC: C0G; TOL: 0.5pF; VOLTAGE: 10V
C17 C19 C103 C107 = Capacitors:C-: Capacitor, Surface Mount; MANUFACTURER: Kemet; MPN: C0603C160J5GACTU; PART_NO: C0603C160J5GACTU; TC: X7R; TOL: 10%; VOLTAGE: 6.3V
C18 C54 C208 = Capacitors:C-: Capacitor, Surface Mount; MANUFACTURER: Kemet; MPN: C0603C475M8PACTU; PART_NO: C0603C475M8PACTU; TC: X5R; TOL: 10%; VOLTAGE: 6.3V
C23-C27 C205 = Capacitors:C-: Capacitor, Surface Mount; MANUFACTURER: Kemet; MPN: C0805C226M8PAC7800; PART_NO: C0805C226M8PAC7800; TC: X5R; TOL: 10%; VOLTAGE: 10V
C28 = Capacitors:C-: Capacitor, Surface Mount; MANUFACTURER: Kemet; MPN: C0402C103K8RACTU; PART_NO: C0402C103K8RACTU; TC: X7R; TOL: 10%; VOLTAGE: 6.3V
C46 = Capacitors:C-: Capacitor, Surface Mount; MANUFACTURER: Kemet; MPN: C0603C225K8RACTU; PART_NO: C0603C225K8RACTU; TC: X7R; TOL: 10%; VOLTAGE: 6.3V
C47 = Capacitors:C-: Capacitor, Surface Mount; MANUFACTURER: Kemet; MPN: C0402C105K8PACTU; PART_NO: C0402C105K8PACTU; TC: X7R; TOL: 10%; VOLTAGE: 10V
C55 C56 = Capacitors:C-: Capacitor, Surface Mount; MANUFACTURER: Kemet; MPN: C0402C180J8GAC7867; PART_NO: C0402C180J8GAC7867; TC: X7R; TOL: 10%; VOLTAGE: 6.3V
C108 = Capacitors:C-: Capacitor, Surface Mount; MANUFACTURER: Kemet; MPN: C0603C100K8RAC7867; PART_NO: C0603C100K8RAC7867; TC: X7R; TOL: 10%; VOLTAGE: 6.3V
D1 = adafruit:DIODE: Diode SMADIODE - SMA Surface Mount Package 20V 1A Schottky Diode Digikey: 641-1014-6-ND DO-1N4148 - Through Hole Small Current Diode SOD-123 20V 1 A (.5mV Vf) Schottky Diode - Digikey: MBRX120TPMSCT-ND SOD-323 10V 570mA (.38mV Vf, 3ns) Schottky Diode - Digikey: ZLLS410CT-ND SOD-523 30V 30mA Schottky Diode (RB751S-40TE61) - Digikey: RB751S-40TE61CT-ND SOT23-R/W - SOT23 Package (R = Solder Paste/Reflow Ovens, W = Hand-Soldering) BAT54Film 40V 300mA - Digikey: 497-7162-1-ND; MPN: MBR120VLSFT3G; PART_NO: MBR120VLSFT3G
D2 = Diodes:BGX50A: Bridge Rectifier from InfineonTechnologies Datasheet: https://www.infineon.com/dgdl/bgx50aseries.pdf?folderId=db3a30431400ef6801141cc1c4cd04e8&fileId=db3a30431400ef6801141cc423c404e9; MANUFACTURER: Infineon Technologies; MPN: BGX50AE6327HTSA1; PART_NO: BGX50AE6327HTSA1
F2 = adafruit:PTCFUSE: PTC fuses, resettable thermistors; MPN: MF-MSMF050-2; PART_NO: MF-MSMF050-2
J1 J2 = Connectors:J-JTAG-CORTEX: Cortex Debug Connector - 10 pin Supports JTAG debug, Serial Wire debug, and Serial Wire Viewer. PTH and SMD connector options available. General Connector Information <http://infocenter.arm.com/help/topic/com.arm.doc.faqs/attached/13634/cortex_debug_connectors.pdf> Products: PTH Connector <http://www.digikey.com/product-detail/en/cnc-tech/3220-10-0100-00/1175-1627-ND/3883661> -via Digi-Key SparkFun PSoc <https://www.sparkfun.com/products/13229> SparkFun T <https://www.sparkfun.com/products/13810>; MANUFACTURER: Samtech Inc.; MPN: FTSH-105-01-L-DV-K-TR; PART_NO: FTSH-105-01-L-DV-K-TR
J3 = Connectors:J-JTAG-CORTEX-NEEDLE6: Adaptor, j-Link To Pcb, 6 Pin Needle Design verified by Reese
J4 = Connectors:J-SERIAL-PORT: Arduino-style serial port connector Mates with the corresponding FTDI USB Serial cable. The attribute "DESCRIPTION" can be set to a string that will show on the schematic and the silkscreen.; DESCRIPTION: Console; DIGIKEY: 2057-PH1-06-UA-ND; MANUFACTURER: Adam Tech; MPN: PH1-06-UA; PART_NO: PH1-06-UA
J5 = Connectors:J-WURTH-USBC: USB 3.1 Type C Receptacle SMT ConUSB31 632723X00011 Characteristics INSULATOR: LCP FLAMMABILITY RATING: UL94-V0 COLOR: BLACK CONTACT MATERIAL: BRASS CONTACT PLATING: GOLD OVERPd-Ni CONTACT AREA: 30μ’’ Pd-Ni+2μ’’ Gold QUALITY CLASS: 10 000 MATING CYCLES OPERATING TEMPERATURE:-25°C UP TO +105°C COMPLIANCE: LEAD FREE AND ROHS ELECTRICAL CURRENT RATING: 3 A MAX WORKING VOLTAGE: 5 VDC WITHSTANDING VOLTAGE: 100 VAC/MIN INSULATION RESISTANCE: >1000 MΩ CONTACT RESISTANCE: 30 mΩ MAX <http://katalog.we-online.de/media/images/v2/Family_632723300011.jpg> Details see: http://katalog.we-online.de/en/em/COM_3_1_THT_SMT_TYPE_C_RECEPTACLE_HORIZONTAL/632723100011 2015 (C) Wurth Elektronik; AVAILABILITY: Unavailable; DESCRIPTION: USB - C _Type - C_ USB 3.1 _USB 3.1 Gen 2, Superspeed+_ Receptacle Connector 24 Position Surface Mount, Right Angle; Through Hole; MF: Wurth Electronics; MPN: 632723100011; PACKAGE: None; PART_NO: 632723100011; PRICE: None
J19 = Connectors:J-JST2: JST 2-Pin Connector SMT-RA (S2B-PH-SM4) 4UConnector #17311 SMT (B2B-PH-SM4) THM-RA (S2B-PH) THM (B2B-PH) SMT-RA (SM02B-SRSS-TB) SH (1mm pitch) Connector; MANUFACTURER: JST Sales America Inc.; MPN: S2B-PH-SM4-TB(LF)(SN); PART_NO: S2B-PH-SM4-TB(LF)(SN)
J.USB.DBG = ZX62D-AB-5P8:USBABSMTDIP; MP: ZX62D-AB-5P8(30); MPN: ZX62D-AB-5P8(30); PART_NO: ZX62D-AB-5P8(30)
J.USB.MN = ZX62D-AB-5P8:USBABSMTDIP; MP: ZX62D-AB-5P8(30); MPN: ZX62D-AB-5P8(30); PAR_NO: ZX62D-AB-5P8(30)
J_DBG_TO_MAIN_HDR = Connectors:HIROSE-DF40_30-PIN_CONNECTORS: Hirose DF40 Series 30-pin connector. 0.4mm pitch mezzanine-type connector Part specification and variants: https://www.hirose.com/product/document?clcode=&productname=&series=DF40&documenttype=Catalog&lang=en&documentid=D31649_en; MPN: DF40C-30DP-0.4V(51); PART_NO: DF40C-30DP-0.4V(51); SPICEPREFIX: X
JP.CHRG.MAIN JP.EN.VMEAS JP.EN.VPROC JP.EXT.PWR JP.HUB.VDD JP.IP.ANA JP.IP.AREF JP.IP.CORE JP.IP.OUT JP.IP.PLL JP.IP.RST JP.IP.UTMI JP.IP.VDDIO JP.P.DTR JP.P.PROC JP.P.STOR JP.P.TEMP JP.UART.RX JP.UART.RX.IP JP.UART.TX JP.UART.TX.IP JP.UART.VCC JP.USB.USART JP.USBC.VBUS JP.VDD.MAIN = Connectors:JUMPER-SMT_2_NC_PASTE: Normally closed solder jumper This jumper has an aperture in the stencil to allow solder paste to bridge the split in the wire so it's normally closed (NC). Wick off the solder to open the connection. Reapply solder to reclose the connection.; BOM: EXCLUDE
JP.USB.DBG JP.USBC = Connectors:JUMPER-SMT_2_NO_PASTEFREE: Normally open solder jumper This jumper has an aperture in the stencil to allow solder paste to bridge the split in the wire but it is normally open (NC). Apply solder to close the connection.
JP.USB.DDN JP.USB.DDP JP.USB.MDN JP.USB.MDP JP.USB.VBUSP JP.VREG.SEL = Connectors:JUMPER-SMT_3_1-NC_PASTE: Normally closed solder jumper (1 of 2 connections) This jumper has an aperture in the stencil to allow solder paste to bridge one of the two connections. One connection is normally closed (NC), while the other is normally open (NO). Wick off the solder to open the connection. Reapply solder to reclose the connection. Apply solder to the other side instead to change the current path.
L1 = SparkFun-Coils:INDUCTOR: Inductors Resist changes in electrical current. Basically a coil of wire. SparkFun Products: SparkFun Load Cell Amplifier - HX711 <https://www.sparkfun.com/products/13879> IOIO-OTG - V2.2 <https://www.sparkfun.com/products/13613>; MP: MLZ2012A3R3WT000; MPN: MLZ2012A3R3WT000; PART_NO: MLZ2012A3R3WT000; PROD_ID: NDUC-13076
L2 = Inductors:DLP11SN900HL2L; BUILT_BY: EMA_UL_Team; MANUFACTURER_PART_NUMBER: DLP11SN900HL2L; MPN: DLP11SN900HL2L; PART_NO: DLP11SN900HL2L; SOURCELIBRARY: Murata_2010-01-01DLP; VENDOR: Murata
L101 L102 = Inductors:MH2029-300Y: Ferrite Bead; MANUFACTURER: Bourns; MPN: MH2029-300Y; PART_NO: MH2029-300Y
L103 L104 = Inductors:MH2029-300Y: Ferrite Bead; MANUFACTURER: Bourns; MPN: MH2029-300Y; PART_NO: MH2029-300Y; SPICEPREFIX: L
Q3 Q5 Q7 Q9 = Switches:FDN340P: SINGLE P-CHANNEL, LOGIC LEVEL, POWERTRENCH MOSFET; CENTROID_NOT_SPECIFIED: No; DATASHEET: https://www.fairchildsemi.com/datasheets/FD/FDN340P.pdf; DIGIKEY_DESCRIPTION: TRANS MOSFET P-CH 20V 2A SSOT3; DIGIKEY_PART_NUMBER: FDN340PCT-ND; LEAD_FREE: yes; MF: ON Semi; MOUSER_PART_NUMBER: 512-FDN340P; MPN: FDN340P; PACKAGE: SuperSOT-3; PART_NO: FDN340P; PREFIX: Q; ROHS: yes; TEMPERATURE_RANGE_HIGH: +150°C; TEMPERATURE_RANGE_LOW: -55°C
Q4 Q6 Q8 Q10 = Switches:2N7002P: Nexperia/NXP N-channel Trench MOSFET; DATASHEET: https://upverter.com/datasheet/fb14709cfa772e514417e9088b71c82dd430e406.pdf; DIGIKEY_DESCRIPTION: TRANS; IMPORTED_FROM: octopart; LEAD_FREE: yes; MF: NXP; MFG_PACKAGE_IDENT: TO-236AB; MPN: 2N7002P; NUM_PINS: 3; OCTOPART_PART_NUMBER: 9df555e57fce4232; PACKAGE: SOT23-3; PART_NO: 2N7002P; POLARITY: N-Channel; PREFIX: Q; ROHS: yes; TEMPERATURE_RANGE_HIGH: +150°C; TEMPERATURE_RANGE_LOW: -55°C
R1 = Resistors:R-: Resistor, Surface Mount; MPN: ERJ-S1D0R00U; PART_NO: ERJ-S1D0R00U
R2 R3 R6 R46 R47 R49 R50 R202 R204 = Resistors:R-: Resistor, Surface Mount; MANUFACTURER: Panasonic; MPN: ERJ-2GEJ104X; PART_NO: ERJ-2GEJ104X; TOL: 5%
R4 R5 = Resistors:R-: Resistor, Surface Mount; MANUFACTURER: Panasonic; MPN: ERJ-2GEJ472X; PART_NO: ERJ-2GEJ472X; TOL: 5%
R7 = Resistors:R-: Resistor, Surface Mount; MANUFACTURER: Panasonic; MPN: ERJ-U02J105X; PART_NO: ERJ-U02J105X; TOL: 5%
R8 R41 = Resistors:R-: Resistor, Surface Mount; MANUFACTURER: Panasonic; MPN: RC0402JR-07100KL; PART_NO: RC0402JR-07100KL; TOL: 5%
R16 R24 R25 R40 = Resistors:R-: Resistor, Surface Mount; MANUFACTURER: Panasonic; MPN: ERA-2AEB2491X; PART_NO: ERA-2AEB2491X; TOL: 0,1%
R17 R26 R33 R53 = Resistors:R-: Resistor, Surface Mount; MANUFACTURER: Panasonic; MPN: ERA-2AEB103X; PART_NO: ERA-2AEB103X; SPICEPREFIX: R; TOL: 0.1%
R18 R27 R34 R54 = Resistors:R-: Resistor, Surface Mount; MANUFACTURER: Panasonic; MPN: ERJ-2RKF1003X; PART_NO: ERJ-2RKF1003X; TOL: 1%
R19 R28 R35 R55 = Resistors:R-: Resistor, Surface Mount; MANUFACTURER: Panasonic; MPN: ERA-2AEB103X; PART_NO: ERA-2AEB103X; TOL: 0.1%
R20 R29 R36 R56 = Resistors:R-: Resistor, Surface Mount; MANUFACTURER: Panasonic; MPN: ERA-2AEB2491X; PART_NO: ERA-2AEB2491X; TOL: 0.1%
R21 R30 R37 R57 = Resistors:R-: Resistor, Surface Mount; MANUFACTURER: Panasonic; MPN: ERJ-2RKF1002X; PART_NO: ERJ-2RKF1002X; TOL: 1%
R22 R23 R31 R32 R38 R39 R58 R59 = Resistors:R-: Resistor, Surface Mount; MANUFACTURER: Panasonic; MPN: ERJ-3BQF5R1V; PART_NO: ERJ-3BQF5R1V; TOL: 1%
R42 R43 = Resistors:R-: Resistor, Surface Mount; MANUFACTURER: Panasonic; MPN: ERJ-2GEJ512X; PART_NO: ERJ-2GEJ512X; TOL: 5%
R44 R45 R51 R52 R206 = Resistors:R-: Resistor, Surface Mount; MANUFACTURER: Panasonic; MPN: ERJ-2GEJ103X; PART_NO: ERJ-2GEJ103X; TOL: 5%
R48 = Resistors:R-: Resistor, Surface Mount; MANUFACTURER: Panasonic; MPN: ERJ-2RKF1202X; PART_NO: ERJ-2RKF1202X; TOL: 1%
R101 R102 = Resistors:R-: Resistor, Surface Mount; MANUFACTURER: Panasonic; MPN: ERJ-2GEJ390X; PART_NO: ERJ-2GEJ390X; TOL: 5%
R103 = Resistors:R-: Resistor, Surface Mount; MANUFACTURER: Panasonic; MPN: ERJ-2GEJ682X; PART_NO: ERJ-2GEJ682X; TOL: 5%
R201 = Resistors:R-: Resistor, Surface Mount; MANUFACTURER: Panasonic; MPN: ERJ-2GEJ274X; PART_NO: ERJ-2GEJ274X; TOL: 5%
R203 = Resistors:R-: Resistor, Surface Mount; MANUFACTURER: Panasonic; MPN: ERJ-2GEJ202X; PART_NO: ERJ-2GEJ202X; TOL: 5%
S201 = Switches:SLIDESWITCH-SPDT: Single Pole, Double Throw (SPDT) Switch Single-pole, double-throw (SPDT) switch. Variant Overview SMD-AYZ0202 Surface Mount DPDT Switch <https://www.sparkfun.com/products/597> (COM-00597) Used on e.g. LilyPad Arduino USB - ATmega32U4 Board <https://www.sparkfun.com/products/12049> PTH-11.6X4.0MM SPDT Mini Power Switch <https://www.sparkfun.com/products/102> (COM-00102) Used on e.g. SparkFun Simon Says - Through-Hole Soldering Kit <https://www.sparkfun.com/products/10547> (KIT-10547) PTH-11.6X4.0MM-KIT KIT version of SPDT Mini Power Switch - Simplifies soldering by removing tStop of switch pins - only one side can be soldered. PTH-11.6X4.0MM-LOCK LOCK version of SPDT Mini Power Switch - Offset pins hold switch in place for easier soldering. SMD-RIGHT-ANGLE Surface Mount Right Angle Switch <https://www.sparkfun.com/products/10860> (COM-10860) Used on e.g. SparkFun ESP8266 Thing <https://www.sparkfun.com/products/13231>; MANUFACTURER: Nidec Copal Electronics; MPN: CUS-12TB; PART_NO: CUS-12TB
S.ERASE S.NRST = Switches:SW_EVQ-P7L01P_SPST_RA: Switch Tactile N.O. SPST Rectangular Button Gull Wing 0.05A 12VDC 100000Cycle 1.6N SMD Embossed T/R; DESCRIPTION: Tactile Switch SPST-NO Side Actuated Surface Mount, Right Angle; MF: Panasonic; MP: EVQP7L01P; MPN: EVQP7L01P; PART_NO: EVQP7L01P
U1 = Regulators:AP2120N; MPN: AP2120N-3.3TRG1; PART_NO: AP2120N-3.3TRG1
U2 = Regulators:TLV1117LV33DCYR: TI TLV1117LV33DCYR 3.3V LDO Regulator; BUILT_BY: EMA_UL_Team; MANUFACTURER: Texas Instruments; MANUFACTURER_PART_NUMBER: TLV1117LV33DCYR; MPN: TLV1117LV33DCYR; PART_NO: TLV1117LV33DCYR; VENDOR: Texas Instruments
U5 U7 U9 U14 = Amplifiers:INA225AIDGK: Texas Instruments INA335AIDGK Differential Amplifier with 4-option programmable gain Datasheet: https://www.ti.com/lit/ds/symlink/ina225.pdf?ts=1590715773259; BUILT_BY: EMA_UL_Team; MANUFACTURER_PART_NUMBER: INA225AIDGKT; MPN: INA225AIDGKT; PART_NO: INA225AIDGKT; VENDOR: Texas Instruments
U6 U8 U10 U15 = Amplifiers:OPA357AIDBVTG4: TI-OPA357AIDBVTG4 Operational Amplifier Datasheet: https://www.ti.com/lit/ds/symlink/opa2357.pdf?HQS=TI-null-null-digikeymode-df-pf-null-wwe&ts=1590718557501; 2ND_HARMONICDBC: 75; 3RD_HARMONICDBC: 83; ACL_MIN_STABLE_GAINVV: 1; BW__ACLMHZ: 250; CIIVA_IDS: 1333678; CODE__JEDEC: MO-178; COMPONENT_LINK_1_DESCRIPTION: Manufacturer URL; COMPONENT_LINK_1_URL: http://www.ti.com/; COMPONENT_LINK_3_DESCRIPTION: Package Specification; COMPONENT_LINK_3_URL: http://www.ti.com/litv/pdf/mpds026h; DATASHEET: http://www.ti.com/general/docs/lit/getliterature.tsp?genericPartNumber=OPA357&fileType=pdf; DATASHEET_VERSION: SBOS235E; DIFF_GAIN: 0.02; DIFF_PHASEDEG: 0.09; FOOTPRINT_VARIANT_NAME_0: Level C; FOOTPRINT_VARIANT_NAME_1: Level B; FOOTPRINT_VARIANT_NAME_2: Level A; IIB_MAXN_A: 0.05; IMPORTED: yes; IMPORTED_FROM: vault; IMPORT_TS: 1521853826; IO_TYPM_A: 100; IQ_PER_CHANNELMAXMA: 7.5; MF: Texas Instruments; MHZ: 1; MOUNTING_TECHNOLOGY: Surface Mount; MPN: OPA357AIDBVTG4; NUMBER_OF_CHANNELS: 1; PACKAGE: DBV6; PACKAGE_DESCRIPTION: 6-Pin Plastic Small Outline, Body 1.6 x 2.9 mm, Pitch 0.95 mm; PACKAGE_VERSION: 4073253-5/K, 03/2006; PART_NO: OPA357AIDBVTG4; PREFIX: U; RAIL__RAIL: In, Out; RELEASE_DATE: 1370004439; ROHS: Yes; SETTLING_TIME_01TYPNS: 30; SLEW_RATETYPVUS: 150; SUB_FAMILY: High Output Current Amplifier (>=50mA), High Speed Amplifier (>=50MHz), Low Supply Voltage Amplifier (<=2.7V); THD_FC_IS_1_MHZTYPDB: -74; VAULT_GUID: CB56EDB0-23E6-4CBA-8F03-D217D127685E; VAULT_REVISION: BD2B64F2-B79F-4C97-B6D3-B17A72B69E93; VIO_MAXM_V: 8; VN_AT_FLATBANDTYPNVRTHZ: 6.5; VS_MAX_V: 5.5; VS_MIN_V: 2.5
U11 = DACs:DAC7574IDGS: TI DAC7574, Quad, 12-bit digital-to-analog converter with I2C interface datasheet: https://www.ti.com/lit/ds/symlink/dac7574.pdf?ts=1591470520597; DATASHEET_URL: http://www.ti.com/lit/gpn/DAC7574; DESCRIPTION: 12-Bit Quad Voltage Output Digital-to-Analog Converter w/ I2C Interface; FAMILY_NAME: PRECISION DAC (=<10MSPS); GENERIC_PART_NUMBER: DAC7574; INDUSTRY_STD_PKG_TYPE: MSOP; MANUFACTURER: Texas Instruments; MANUFACTURER_PART_NUMBER: DAC7574IDGS; MPN: DAC7574IDGS; PACKAGE_DESIGNATOR: DGS; PART_NO: DAC7574IDGS; PIN_COUNT: 10; VENDOR: Texas Instruments
U12 = Chargers:MCP73871T-2CCI/ML: IC USB/AC BATT CHRGR W/PPM 20QFN; DESCRIPTION: Fully Integrated Single Cell Lithium Ion/Lithium Polymer Charge Management Contr; DIGI-KEY_PART_NUMBER: MCP73871T-2CCI/MLCT-ND; DIGI-KEY_PURCHASE_URL: https://www.digikey.com/product-detail/en/microchip-technology/MCP73871T-2CCI-ML/MCP73871T-2CCI-MLCT-ND/7065594?utm_source=snapeda&utm_medium=aggregator&utm_campaign=symbol; MF: Microchip; MP: MCP73871T-2CCI/ML; MPN: MCP73871T-2CCI/ML; PACKAGE: QFN-20 Microchip; PART_NO: MCP73871T-2CCI/ML
U13 = Switches:USB2412-DZK; BUILT_BY: EMA_Jessica; COPYRIGHT: Copyright (C) 2018 Accelerated Designs. All rights reserved; MANUFACTURER_PART_NUMBER: USB2412-DZK; MPN: USB2412-DZK; PART_NO: USB2412-DZK; SOURCELIBRARY: Microchip_2019-08-23_1; VENDOR: Microchip
U_INSTR_PROC = Processors:ATSAM3X8EA: ATSAM3X8EA ARM-based Flash MCU; MANUFACTURER: Atmel; MPN: ATSAM3X8EAAU
VR1-VR8 = Diodes:VARISTOR: Varistor; MANUFACTURER: Bourns; MPN: CG0603MLC-05E; PART_NO: CG0603MLC-05E
Y1 = Oscillators:EPSON_TSX-3225_24.0000MF10Z-C3; BUILT_BY: EMA_Matt; COPYRIGHT: Copyright (C) 2018 Accelerated Designs. All rights reserved; MANUFACTURER_PART_NUMBER: TSX-3225 24.0000MF10Z-C3; MPN: TSX-3225 24.0000MF10Z-C3; PART_NO: TSX-3225 24.0000MF10Z-C3; VENDOR: Epson
Y101 = Oscillators:CRYSTAL: Crystal; MANUFACTURER: ECS Inc.; MPN: ECS-.327-12.5-34B-TR; PART_NO: ECS-.327-12.5-34B-TR
Y102 = Oscillators:0396_12MHZ-12PF-K7: Crystal; MANUFACTURER: Abracon; MPN: ABM8G-12.000MHZ-4Y-T3; PART_NO: ABM8G-12.000MHZ-4Y-T3

## Net classes
1 power: width 0.254 mm
2 power_5: width 0.254 mm
5 10_mil: width 0.254 mm
8 GND: width 0.127 mm